# Altium project LimeSDR-Mini_2v4.PrjPcb (part 1 of 2)
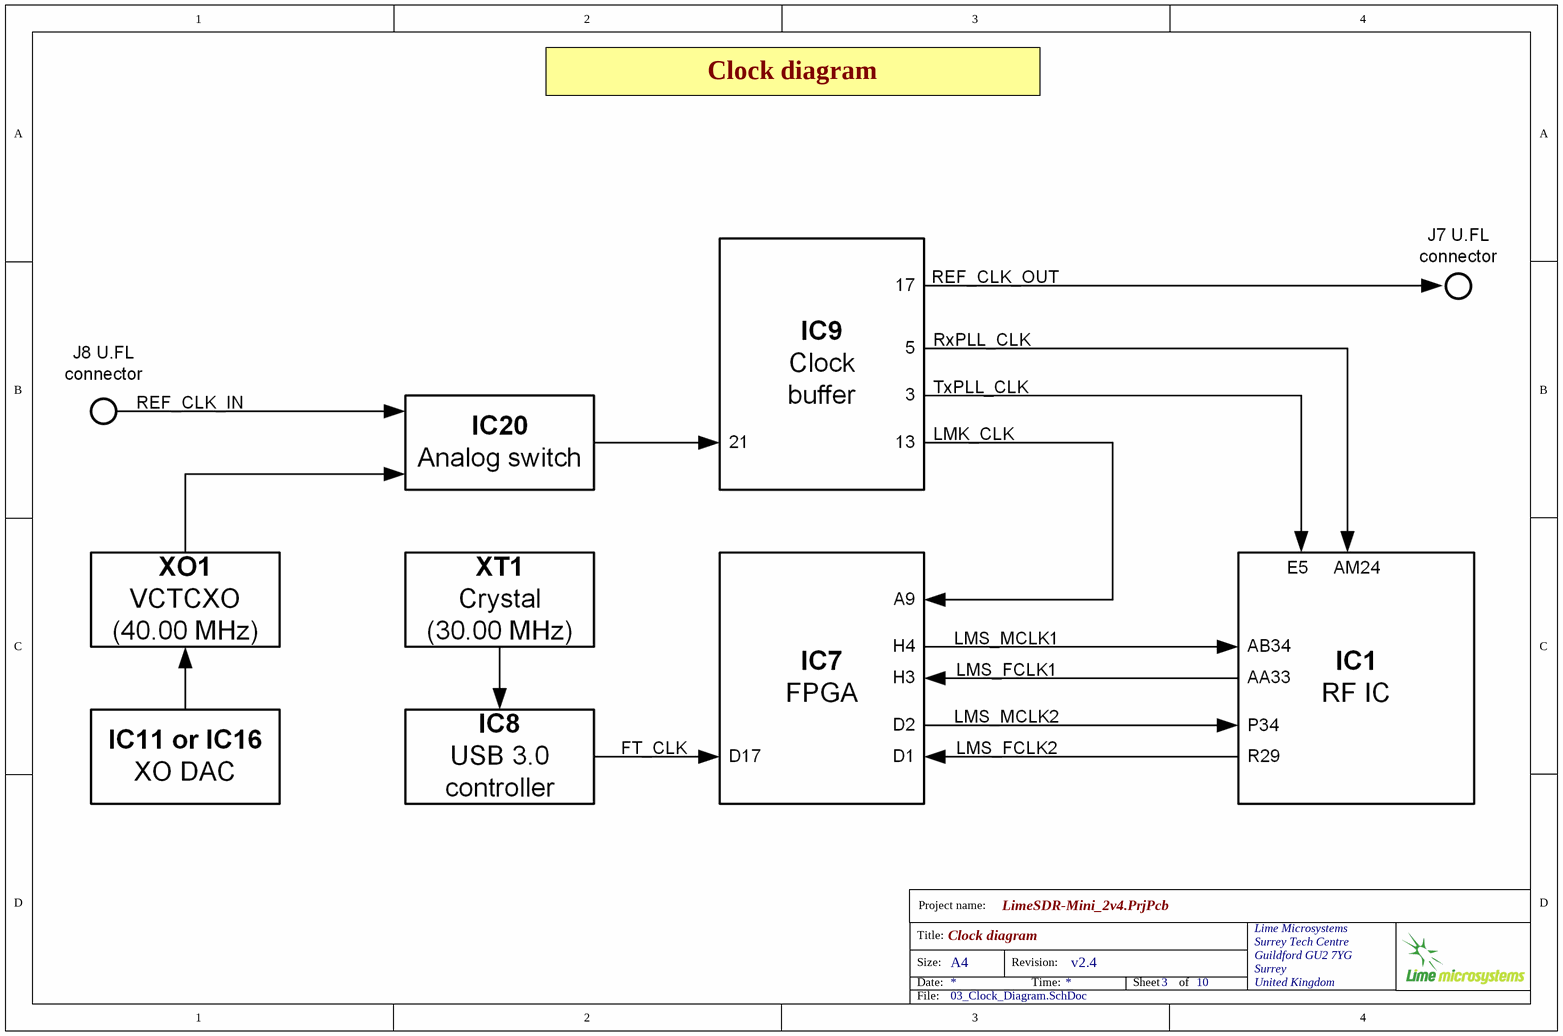
[diagram p0: 03_Clock_Diagram.SchDoc]
5 sheets, 279 parts. Net scope: global (net labels, ports and power ports of the same name join across sheets).
Board files: LimeSDR-Mini_2v4_Rounded.PcbDoc, LimeSDR-Mini_2v4_Rounded_panel.PcbDoc
Sheets:
  03_Clock_Diagram.SchDoc
  04_RF_Diagram.SchDoc
  07_LMS7002M_Power.SchDoc
  09_USB3_0_FIFO.SchDoc
  10_Misc.SchDoc

## Sheet 03_Clock_Diagram.SchDoc: Clock diagram
size A4; Organization: Lime Microsystems; Address1: Surrey Tech Centre; Address2: Guildford GU2 7YG; Address3: Surrey; Address4: United Kingdom; Revision: v2.4; SheetNumber: 3; SheetTotal: 10

### Notes on the sheet
- Clock diagram
- Project name:
- Title:
- Size:
- Date:
- A4
- Revision:
- Time:
- Sheet
- of
- File:

## Sheet 04_RF_Diagram.SchDoc: RF diagram
size A4; Organization: Lime Microsystems; Address1: Surrey Tech Centre; Address2: Guildford GU2 7YG; Address3: Surrey; Address4: United Kingdom; Revision: v2.4; SheetNumber: 4; SheetTotal: 10
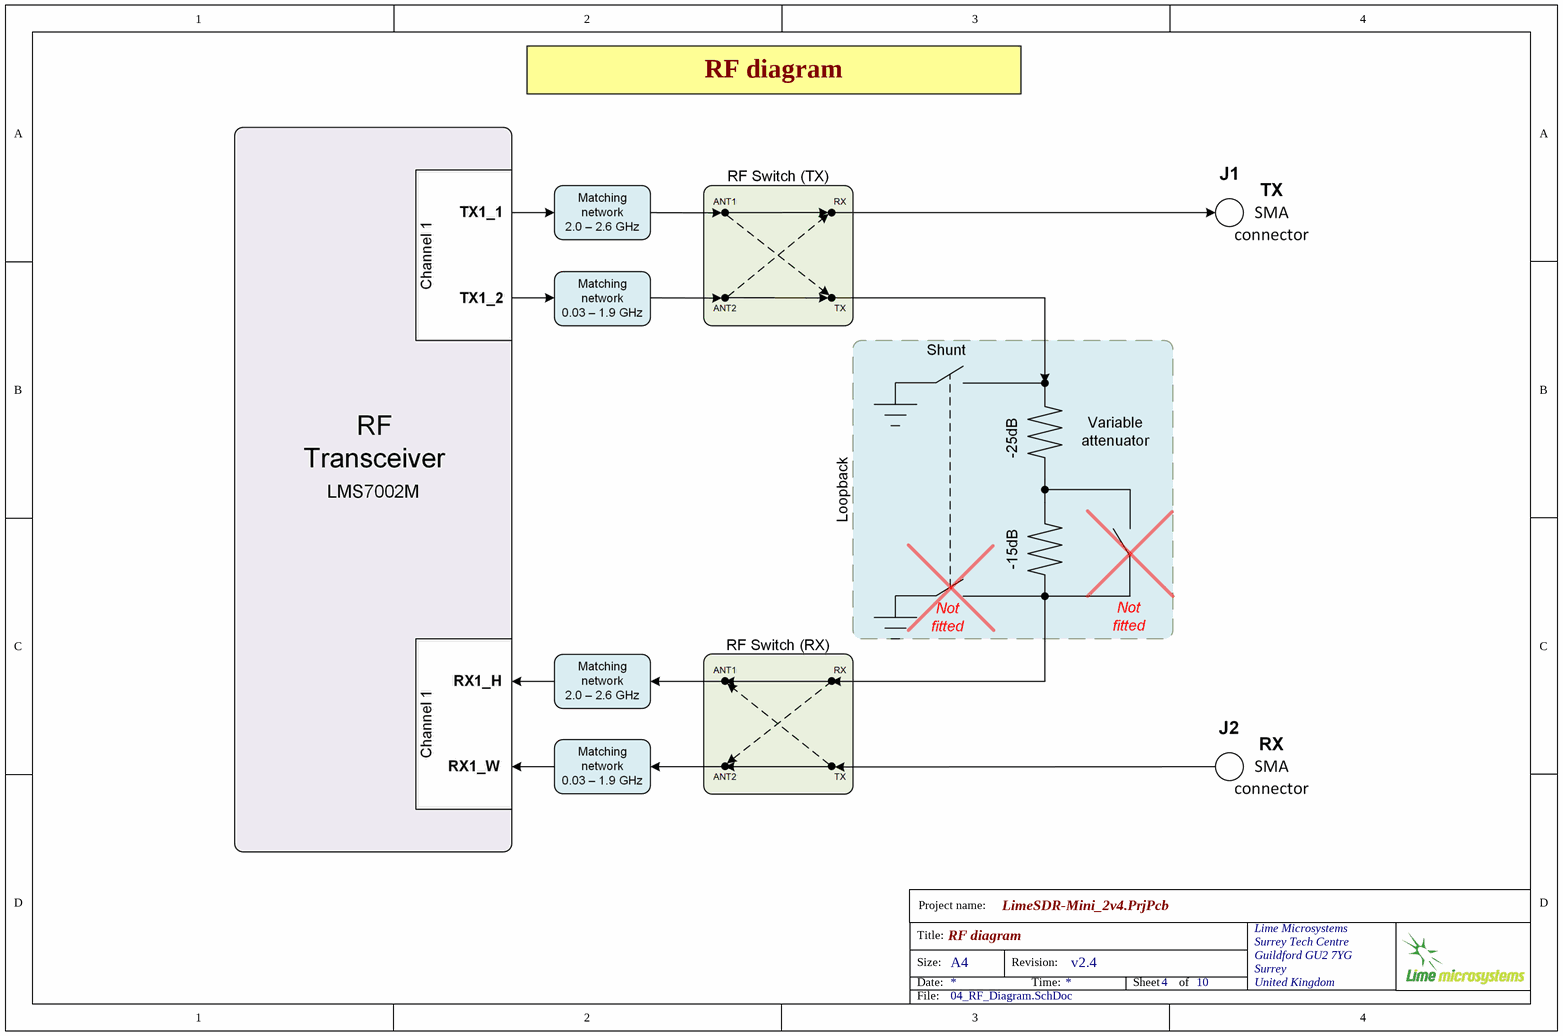
[diagram p1: 04_RF_Diagram.SchDoc]

### Notes on the sheet
- RF diagram
- Project name:
- Title:
- Size:
- Date:
- A4
- Revision:
- Time:
- Sheet
- of
- File:

## Sheet 07_LMS7002M_Power.SchDoc: LMS7002M power
size A3; Organization: Lime Microsystems; Address1: Surrey Tech Centre; Address2: Guildford GU2 7YG; Address3: Surrey; Address4: United Kingdom; Revision: v2.4; SheetNumber: 7; SheetTotal: 10
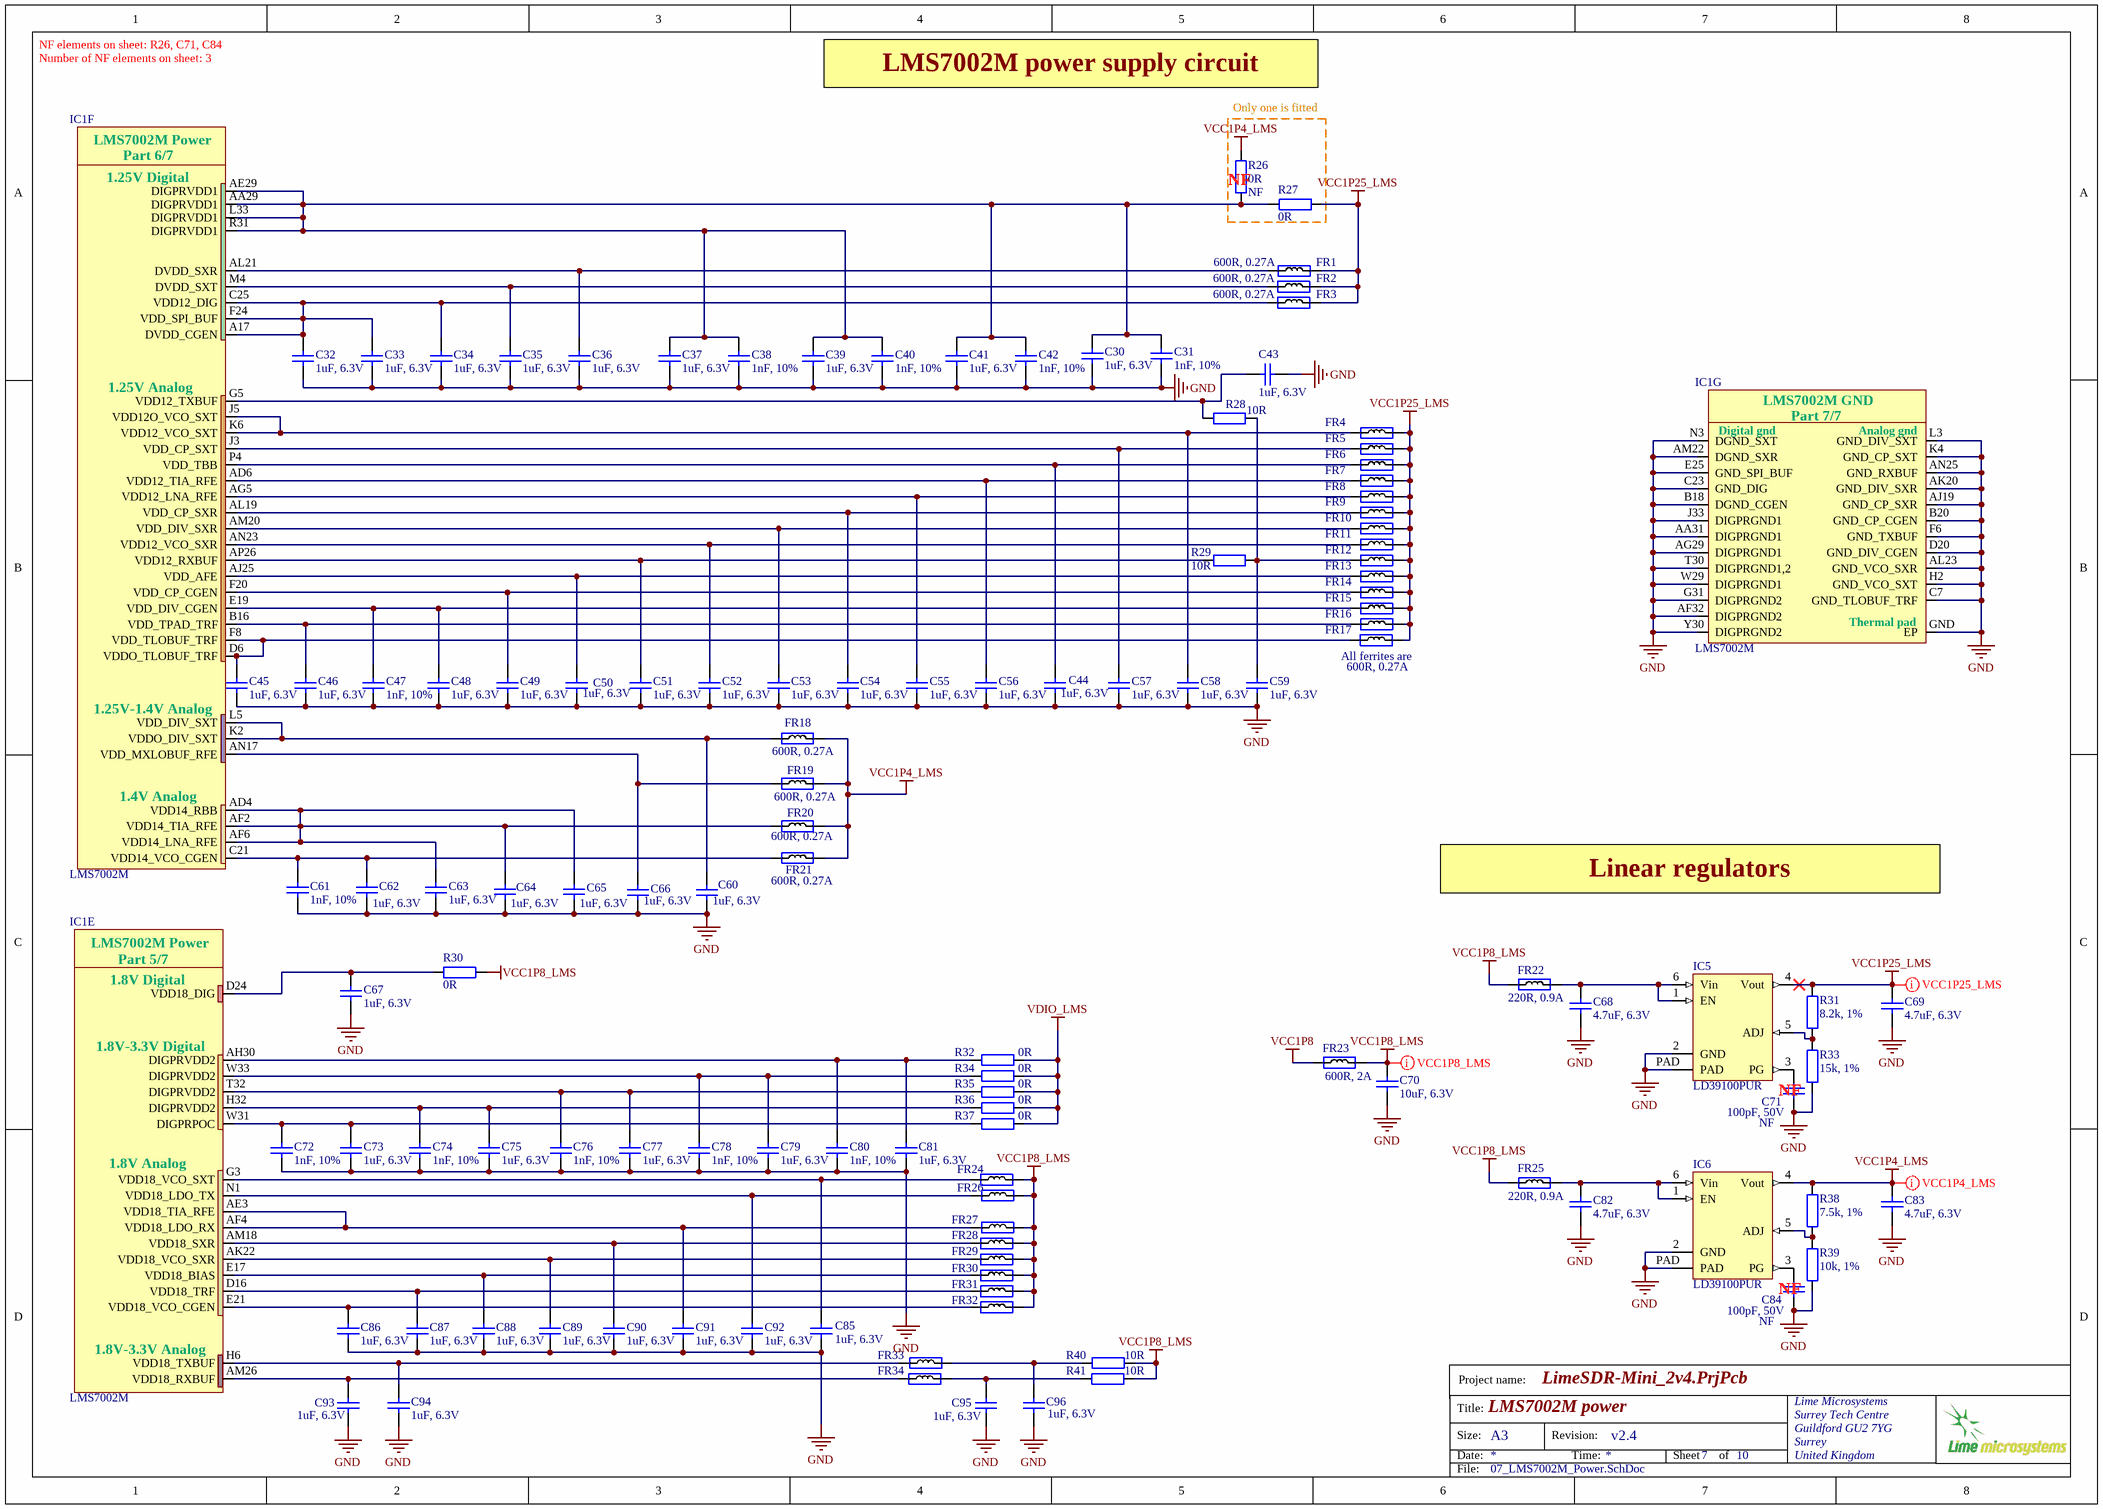
[diagram p2: 07_LMS7002M_Power.SchDoc]

### Parts
C30  1uF, 6.3V  [CAP0201]
C31  1nF, 10%  [CAP0201]
C32  1uF, 6.3V  [CAP0201]
C33  1uF, 6.3V  [CAP0201]
C34  1uF, 6.3V  [CAP0201]
C35  1uF, 6.3V  [CAP0201]
C36  1uF, 6.3V  [CAP0201]
C37  1uF, 6.3V  [CAP0201]
C38  1nF, 10%  [CAP0201]
C39  1uF, 6.3V  [CAP0201]
C40  1nF, 10%  [CAP0201]
C41  1uF, 6.3V  [CAP0201]
C42  1nF, 10%  [CAP0201]
C43  1uF, 6.3V  [CAP0201]
C44  1uF, 6.3V  [CAP0201]
C45  1uF, 6.3V  [CAP0201]
C46  1uF, 6.3V  [CAP0201]
C47  1nF, 10%  [CAP0201]
C48  1uF, 6.3V  [CAP0201]
C49  1uF, 6.3V  [CAP0201]
C50  1uF, 6.3V  [CAP0201]
C51  1uF, 6.3V  [CAP0201]
C52  1uF, 6.3V  [CAP0201]
C53  1uF, 6.3V  [CAP0201]
C54  1uF, 6.3V  [CAP0201]
C55  1uF, 6.3V  [CAP0201]
C56  1uF, 6.3V  [CAP0201]
C57  1uF, 6.3V  [CAP0201]
C58  1uF, 6.3V  [CAP0201]
C59  1uF, 6.3V  [CAP0201]
C60  1uF, 6.3V  [CAP0201]
C61  1nF, 10%  [CAP0201]
C62  1uF, 6.3V  [CAP0201]
C63  1uF, 6.3V  [CAP0201]
C64  1uF, 6.3V  [CAP0201]
C65  1uF, 6.3V  [CAP0201]
C66  1uF, 6.3V  [CAP0201]
C67  1uF, 6.3V  [CAP0201]
C68  4.7uF, 6.3V  [CAP0402]
C69  4.7uF, 6.3V  [CAP0402]
C70  10uF, 6.3V  [CAP0603]
C71  100pF, 50V  Assembly Info: NF  [CAP0402]
C72  1nF, 10%  [CAP0201]
C73  1uF, 6.3V  [CAP0201]
C74  1nF, 10%  [CAP0201]
C75  1uF, 6.3V  [CAP0201]
C76  1nF, 10%  [CAP0201]
C77  1uF, 6.3V  [CAP0201]
C78  1nF, 10%  [CAP0201]
C79  1uF, 6.3V  [CAP0201]
C80  1nF, 10%  [CAP0201]
C81  1uF, 6.3V  [CAP0201]
C82  4.7uF, 6.3V  [CAP0402]
C83  4.7uF, 6.3V  [CAP0402]
C84  100pF, 50V  Assembly Info: NF  [CAP0402]
C85  1uF, 6.3V  [CAP0201]
C86  1uF, 6.3V  [CAP0201]
C87  1uF, 6.3V  [CAP0201]
C88  1uF, 6.3V  [CAP0201]
C89  1uF, 6.3V  [CAP0201]
C90  1uF, 6.3V  [CAP0201]
C91  1uF, 6.3V  [CAP0201]
C92  1uF, 6.3V  [CAP0201]
C93  1uF, 6.3V  [CAP0201]
C94  1uF, 6.3V  [CAP0201]
C95  1uF, 6.3V  [CAP0201]
C96  1uF, 6.3V  [CAP0201]
FR1  600R, 0.27A  [RES0201]
FR2  600R, 0.27A  [RES0201]
FR3  600R, 0.27A  [RES0201]
FR4  600R, 0.27A  [RES0201]
FR5  600R, 0.27A  [RES0201]  (value not drawn)
FR6  600R, 0.27A  [RES0201]  (value not drawn)
FR7  600R, 0.27A  [RES0201]  (value not drawn)
FR8  600R, 0.27A  [RES0201]  (value not drawn)
FR9  600R, 0.27A  [RES0201]  (value not drawn)
FR10  600R, 0.27A  [RES0201]  (value not drawn)
FR11  600R, 0.27A  [RES0201]  (value not drawn)
FR12  600R, 0.27A  [RES0201]  (value not drawn)
FR13  600R, 0.27A  [RES0201]  (value not drawn)
FR14  600R, 0.27A  [RES0201]  (value not drawn)
FR15  600R, 0.27A  [RES0201]  (value not drawn)
FR16  600R, 0.27A  [RES0201]  (value not drawn)
FR17  600R, 0.27A  [RES0201]  (value not drawn)
FR18  600R, 0.27A  [RES0201]
FR19  600R, 0.27A  [RES0201]
FR20  600R, 0.27A  [RES0201]
FR21  600R, 0.27A  [RES0201]
FR22  220R, 0.9A  [RES0402]
FR23  600R, 2A  [RES0805]
FR24  600R, 0.27A  [RES0201]  (value not drawn)
FR25  220R, 0.9A  [RES0402]
FR26  600R, 0.27A  [RES0201]  (value not drawn)
FR27  600R, 0.27A  [RES0201]  (value not drawn)
FR28  600R, 0.27A  [RES0201]  (value not drawn)
FR29  600R, 0.27A  [RES0201]  (value not drawn)
FR30  600R, 0.27A  [RES0201]  (value not drawn)
FR31  600R, 0.27A  [RES0201]  (value not drawn)
FR32  600R, 0.27A  [RES0201]  (value not drawn)
FR33  600R, 0.27A  [RES0201]  (value not drawn)
FR34  600R, 0.27A  [RES0201]  (value not drawn)
IC1  LMS7002M  [LMS7002M_v5]  (parts E,F,G of 7)
IC5  LD39100PUR  [LD39100PUR]
IC6  LD39100PUR  [LD39100PUR]
R26  0R  Assembly Info: NF  [RES0402]
R27  0R  [RES0402]
R28  10R  [RES0201]
R29  10R  [RES0201]
R30  0R  [RES0201]
R31  8.2k, 1%  [RES0402]
R32  0R  [RES0402]
R33  15k, 1%  [RES0402]
R34  0R  [RES0402]
R35  0R  [RES0402]
R36  0R  [RES0402]
R37  0R  [RES0402]
R38  7.5k, 1%  [RES0402]
R39  10k, 1%  [RES0402]
R40  10R  [RES0201]
R41  10R  [RES0201]

### Blocks framed on the sheet
Only one is fitted: R26 R27

### Nets
GND: C30.2 C31.2 C32.2 C33.2 C34.2 C35.1 C36.2 C37.2 C38.2 C39.2 C40.2 C41.2 C42.2 C43.2 C44.2 C45.2 C46.2 C47.2 C48.2 C49.1 C50.2 C51.2 C52.2 C53.2 C54.2 C55.2 C56.1 C57.2 C58.1 C59.1 C60.2 C61.2 C62.2 C63.2 C64.2 C65.2 C66.2 C67.2 C68.1 C69.1 C70.1 C71.1 C72.2 C73.2 C74.2 C75.2 C76.2 C77.2 C78.2 C79.2 C80.2 C81.2 C82.1 C83.1 C84.1 C85.2 C86.2 C87.2 C88.2 C89.2 C90.2 C91.2 C92.2 C93.2 C94.2 C95.2 C96.2 IC1.AA31(DIGPRGND1) IC1.AF32(DIGPRGND2) IC1.AG29(DIGPRGND1) IC1.AJ19(GND_CP_SXR) IC1.AK20(GND_DIV_SXR) IC1.AL23(GND_VCO_SXR) IC1.AM22(DGND_SXR) IC1.AN25(GND_RXBUF) IC1.B18(DGND_CGEN) IC1.B20(GND_CP_CGEN) IC1.C7(GND_TLOBUF_TRF) IC1.C23(GND_DIG) IC1.D20(GND_DIV_CGEN) IC1.E25(GND_SPI_BUF) IC1.F6(GND_TXBUF) IC1.G31(DIGPRGND2) IC1.GND(EP) IC1.H2(GND_VCO_SXT) IC1.J33(DIGPRGND1) IC1.K4(GND_CP_SXT) IC1.L3(GND_DIV_SXT) IC1.N3(DGND_SXT) IC1.T30(DIGPRGND1,2) IC1.W29(DIGPRGND1) IC1.Y30(DIGPRGND2) IC5.2(GND) IC5.PAD IC6.2(GND) IC6.PAD R33.1 R39.1
VCC1P4_LMS: C83.2 FR18.2 FR19.2 FR20.2 FR21.2 IC6.4(Vout) R26.1 R38.2
VCC1P8: FR23.1
VCC1P8_LMS: C70.2 FR22.1 FR23.2 FR24.2 FR25.1 FR26.1 FR27.1 FR28.2 FR29.2 FR30.2 FR31.2 FR32.2 R30.2 R40.2 R41.1
VCC1P25_LMS: C69.2 FR1.2 FR2.2 FR3.2 FR4.2 FR5.2 FR6.2 FR7.2 FR8.2 FR9.2 FR10.2 FR11.2 FR12.2 FR13.2 FR14.2 FR15.2 FR16.2 FR17.2 IC5.4(Vout) R27.1 R31.2
VDIO_LMS: R32.1 R34.1 R35.1 R36.1 R37.1
NetC30_1: C30.1 C31.1 C37.1 C38.1 C39.1 C40.1 C41.1 C42.1 IC1.AA29(DIGPRVDD1) IC1.AE29(DIGPRVDD1) IC1.L33(DIGPRVDD1) IC1.R31(DIGPRVDD1) R26.2 R27.2
NetC32_1: C32.1 C33.1 C34.1 FR3.1 IC1.A17(DVDD_CGEN) IC1.C25(VDD12_DIG) IC1.F24(VDD_SPI_BUF)
NetC35_2: C35.2 FR2.1 IC1.M4(DVDD_SXT)
NetC36_1: C36.1 FR1.1 IC1.AL21(DVDD_SXR)
NetC43_1: C43.1 IC1.G5(VDD12_TXBUF) R28.1
NetC44_1: C44.1 FR6.1 IC1.P4(VDD_TBB)
NetC45_1: C45.1 FR17.1 IC1.D6(VDDO_TLOBUF_TRF) IC1.F8(VDD_TLOBUF_TRF)
NetC46_1: C46.1 FR16.1 IC1.B16(VDD_TPAD_TRF)
NetC47_1: C47.1 C48.1 FR15.1 IC1.E19(VDD_DIV_CGEN)
NetC49_2: C49.2 FR14.1 IC1.F20(VDD_CP_CGEN)
NetC50_1: C50.1 FR13.1 IC1.AJ25(VDD_AFE)
NetC51_1: C51.1 IC1.AP26(VDD12_RXBUF) R29.1
NetC52_1: C52.1 FR11.1 IC1.AN23(VDD12_VCO_SXR)
NetC53_1: C53.1 FR10.1 IC1.AM20(VDD_DIV_SXR)
NetC54_1: C54.1 FR9.1 IC1.AL19(VDD_CP_SXR)
NetC55_1: C55.1 FR8.1 IC1.AG5(VDD12_LNA_RFE)
NetC56_2: C56.2 FR7.1 IC1.AD6(VDD12_TIA_RFE)
NetC57_1: C57.1 FR5.1 IC1.J3(VDD_CP_SXT)
NetC58_2: C58.2 FR4.1 IC1.J5(VDD12O_VCO_SXT) IC1.K6(VDD12_VCO_SXT)
NetC59_2: C59.2 FR12.1 R28.2 R29.2
NetC60_1: C60.1 FR18.1 IC1.K2(VDDO_DIV_SXT) IC1.L5(VDD_DIV_SXT)
NetC61_1: C61.1 C62.1 FR21.1 IC1.C21(VDD14_VCO_CGEN)
NetC63_1: C63.1 C64.1 C65.1 FR20.1 IC1.AD4(VDD14_RBB) IC1.AF2(VDD14_TIA_RFE) IC1.AF6(VDD14_LNA_RFE)
NetC66_1: C66.1 FR19.1 IC1.AN17(VDD_MXLOBUF_RFE)
NetC67_1: C67.1 IC1.D24(VDD18_DIG) R30.1
NetC68_2: C68.2 FR22.2 IC5.1(EN) IC5.6(Vin)
NetC71_2: C71.2 IC5.3(PG)
NetC72_1: C72.1 C73.1 IC1.W31(DIGPRPOC) R37.2
NetC74_1: C74.1 C75.1 IC1.H32(DIGPRVDD2) R36.2
NetC76_1: C76.1 C77.1 IC1.T32(DIGPRVDD2) R35.2
NetC78_1: C78.1 C79.1 IC1.W33(DIGPRVDD2) R34.2
NetC80_1: C80.1 C81.1 IC1.AH30(DIGPRVDD2) R32.2
NetC82_2: C82.2 FR25.2 IC6.1(EN) IC6.6(Vin)
NetC84_2: C84.2 IC6.3(PG)
NetC85_1: C85.1 FR24.1 IC1.G3(VDD18_VCO_SXT)
NetC86_1: C86.1 FR32.1 IC1.E21(VDD18_VCO_CGEN)
NetC87_1: C87.1 FR31.1 IC1.D16(VDD18_TRF)
NetC88_1: C88.1 FR30.1 IC1.E17(VDD18_BIAS)
NetC89_1: C89.1 FR29.1 IC1.AK22(VDD18_VCO_SXR)
NetC90_1: C90.1 FR28.1 IC1.AM18(VDD18_SXR)
NetC91_1: C91.1 FR27.2 IC1.AE3(VDD18_TIA_RFE) IC1.AF4(VDD18_LDO_RX)
NetC92_1: C92.1 FR26.2 IC1.N1(VDD18_LDO_TX)
NetC93_1: C93.1 FR34.1 IC1.AM26(VDD18_RXBUF)
NetC94_1: C94.1 FR33.2 IC1.H6(VDD18_TXBUF)
NetC95_1: C95.1 FR34.2 R41.2
NetC96_1: C96.1 FR33.1 R40.1
NetIC5_5: IC5.5(ADJ) R31.1 R33.2
NetIC6_5: IC6.5(ADJ) R38.1 R39.2

### Layout directives
net class VCC1P25_LMS: VCC1P25_LMS
net class VCC1P4_LMS: VCC1P4_LMS
net class VCC1P8_LMS: VCC1P8_LMS

### Notes on the sheet
- NF elements on sheet: R26, C71, C84
- Number of NF elements on sheet: 3
- LMS7002M power supply circuit
- (near R26) NF
- (near FR17) All ferrites are
- Linear regulators
- NF
- Project name:
- Title:
- Size:
- Date:
- A3
- Revision:
- Time:
- Sheet
- of
- File:
- (in symbol LMS7002Mr4, part E) LMS7002M Power; Part 5/7; 1.8V Digital; 1.8V-3.3V Digital; 1.8V Analog; 1.8V-3.3V Analog
- (in symbol LMS7002Mr4, part F) LMS7002M Power; Part 6/7; 1.25V Digital; 1.25V Analog; 1.25V-1.4V Analog; 1.4V Analog
- (in symbol LMS7002Mr4, part G) LMS7002M GND; Part 7/7; Digital gnd; Analog gnd; Thermal pad

### Library data of the parts
C30 C32-C37 C39 C41 C43-C46 C48-C60 C62-C67 C73 C75 C77 C79 C81 C85-C96 = Cap_0402: Manufacturer: TDK Corporation; Manufacturer Part Number 1: JMK063ABJ105MP-F; Part Description: 1µF ±20% 6.3V X5R Ceramic Capacitor -55°C ~ 85°C Surface Mount, MLCC 0201 (0603 Metric) 0.024" L x 0.012" W (0.60mm x 0.30mm); Value: 1uF, 20%; Tolerance: ±20%; Capacitance: 1.0µF; Temperature Coefficient: X5R; Supplier 1: Digi-Key; Supplier Part Number 1: 587-5864-2-ND; Applications: General Purpose; Features: -; Lead Style: -; Ratings: -; Thickness (Max): -; Lead Spacing: -; Height - Seated (Max): -; Size / Dimension: 0.024" L x 0.012" W (0.60mm x 0.30mm); Mounting Type: Surface Mount, MLCC; Operating Temperature: -55°C ~ 85°C; Package / Case: 0201 (0603 Metric); Packaging: Cut Tape (CT); Voltage - Rated: 6.3V; Category: Capacitors; RoHS: RoHS Compliant
C31 C38 C40 C42 C47 C61 C72 C74 C76 C78 C80 = Cap_0402: Manufacturer Part Number 1: C0603X7R1E102K030BA; Manufacturer: TDK Corporation; Part Description: 1000pF ±10% 25V X7R Ceramic Capacitor -55°C ~ 125°C Surface Mount, MLCC 0201 (0603 Metric) 0.024" L x 0.012" W (0.60mm x 0.30mm); Voltage - Rated: 25V; Temperature Coefficient: X7R; Capacitance: 1000pF; Value: 1nF, 10%; Supplier 1: Digi-Key; Supplier Part Number 1: 445-7275-1-ND; Features: -; Package / Case: 0201 (0603 Metric); Lead Spacing: -; Mounting Type: Surface Mount, MLCC; Lead Style: -; Height - Seated (Max): -; Operating Temperature: -55°C ~ 125°C; Tolerance: ±10%; Size / Dimension: 0.024" L x 0.012" W (0.60mm x 0.30mm); Applications: General Purpose; Ratings: -; Thickness (Max): 0.013" (0.33mm); RoHS: RoHS Compliant; Packaging: Cut Tape (CT); Category: Capacitors
C68 C69 C82 C83 = Cap_0402: Manufacturer: Murata Electronics North America; Manufacturer Part Number 1: GRM155R60J475ME87D; Part Description: 4.7µF ±20% 6.3V X5R Ceramic Capacitor -55°C ~ 85°C Surface Mount, MLCC 0402 (1005 Metric) 0.039" L x 0.020" W (1.00mm x 0.50mm); Tolerance: ±20%; Capacitance: 4.7µF; Temperature Coefficient: X5R; Lead Style: -; Ratings: -; Height - Seated (Max): -; Thickness (Max): 0.022" (0.55mm); Voltage - Rated: 6.3V; Packaging: Cut Tape (CT); Lead Spacing: -; Category: Capacitors; Supplier Part Number 1: 490-5408-1-ND; Applications: General Purpose; Operating Temperature: -55°C ~ 85°C; Mounting Type: Surface Mount, MLCC; Features: Derating Recommended; RoHS: RoHS Compliant; Supplier 1: Digi-Key; Package / Case: 0402 (1005 Metric); Size / Dimension: 0.039" L x 0.020" W (1.00mm x 0.50mm); Value: 4.7uF, 6.3V
C70 = Cap_0603: Manufacturer Part Number 1: CC0603MRX5R5BB106; Manufacturer: Yageo; Part Description: 10µF ±20% 6.3V X5R Ceramic Capacitor -55°C ~ 85°C Surface Mount, MLCC 0603 (1608 Metric) 0.063" L x 0.031" W (1.60mm x 0.80mm); Capacitance: 10µF; Tolerance: ±20%; Supplier 1: Digi-Key; Supplier Part Number 1: 311-1448-2-ND; Package / Case: 0603 (1608 Metric); Category: Capacitors; Voltage - Rated: 6.3V; Value: 10uF, 6.3V
C71 C84 = Cap_0402: Manufacturer Part Number 1: CC0402JRNPO9BN101; Manufacturer: Yageo; Part Description: 100pF ±5% 50V C0G, NP0 Ceramic Capacitor -55°C ~ 125°C Surface Mount, MLCC 0402 (1005 Metric) 0.039" L x 0.020" W (1.00mm x 0.50mm); Temperature Coefficient: C0G, NP0; Tolerance: ±5%; Value: 100pF, 50V; Supplier 1: Digi-Key; Supplier Part Number 1: 311-1024-1-ND; RoHS: RoHS Compliant; Category: Capacitors; Applications: General Purpose; Mounting Type: Surface Mount, MLCC; Capacitance: 100pF; Ratings: -; Packaging: Cut Tape (CT); Voltage - Rated: 50V; Size / Dimension: 0.039" L x 0.020" W (1.00mm x 0.50mm); Height - Seated (Max): -; Package / Case: 0402 (1005 Metric); Operating Temperature: -55°C ~ 125°C; Features: -; Lead Spacing: -; Lead Style: -; Thickness (Max): 0.022" (0.55mm)
FR1-FR21 FR24 FR26-FR34 = Ferrite: Manufacturer Part Number 1: BK0603TS601-T; Manufacturer: Taiyo Yuden; Part Description: FERRITE BEAD 600 OHM 0201 1LN; DC Resistance (DCR): 750 mOhm Max; Filter Type: Differential Mode - Single; Impedance @ Frequency: 600 Ohm @ 100MHz; Current Rating: 270mA; Value: 600R@100MHz; Supplier 1: Digi-Key; Supplier Part Number 1: 587-3277-1-ND; Size / Dimension: 0.024" L x 0.012" W (0.60mm x 0.30mm); Package / Case: 0201 (0603 Metric); Height (Max): 0.013" (0.33mm); Mounting Type: Surface Mount; Packaging: Cut Tape (CT); RoHS: RoHS Compliant; Category: Filters
FR22 FR25 = Ferrite: Manufacturer: TDK Corporation; Manufacturer Part Number 1: MPZ1005S221ET000; Part Description: FERRITE BEAD 220 OHM 0402 1LN; Impedance @ Frequency: 220 Ohm @ 100MHz; Current Rating: 900mA; DC Resistance (DCR): 220 mOhm Max; Supplier 1: Digi-Key; Package / Case: 0402 (1005 Metric); Category: Filters; Supplier Part Number 1: 445-9329-2-ND; Value: 220R, 0.9A
FR23 = Ferrite: Manufacturer Part Number 1: MPZ2012S601AT000; Manufacturer: TDK Corporation; Part Description: FERRITE BEAD 600 OHM 0805 1LN; Filter Type: Differential Mode - Single; Impedance @ Frequency: 600 Ohm @ 100MHz; DC Resistance (DCR): 100 mOhm Max; Supplier 1: Digi-Key; Supplier Part Number 1: 445-2206-2-ND; Mounting Type: Surface Mount; RoHS: RoHS Compliant; Height (Max): 0.041" (1.05mm); Packaging: Tape & Reel (TR); Category: Filters; Current Rating: 2A; Package / Case: 0805 (2012 Metric); Size / Dimension: 0.079" L x 0.049" W (2.00mm x 1.25mm)
IC1 = LMS7002Mr4: Schematic symbol revision 4. Default footprint - 0.31mm pad; Manufacturer: Lime Microsystems; Part Description: IC FPRF Transceiver LMS7002M; 261 pin aQFN; Supplier 1: Lime Microsystems; Supplier Part Number 1: LMS7002M; Manufacturer Part Number 1: LMS7002M
IC5 IC6 = LD39100PUR: Manufacturer: STMicroelectronics; Part Description: Linear Voltage Regulator IC Positive Adjustable Output 0.8 V ~ 4.5 V 1A 6-DFN (3x3); Output Configuration: Positive; Output Type: Adjustable; Voltage - Input (Max): 5.5V; Voltage - Output (Min/Fixed): 0.8V; Voltage - Output (Max): 4.6V; Voltage Dropout (Max): 0.4V @ 1A; Current - Output: 1A; Current - Supply: 50µA ~ 300µA; PSRR: 70dB ~ 65dB (1kHz ~ 10kHz); Control Features: Enable, Power Good; Protection Features: Over Current, Over Temperature, Short Circuit; Supplier 1: Digi-Key; Manufacturer Part Number 1: LD39100PUR; RoHS: RoHS Compliant; Category: Integrated Circuits (ICs); Stock 1: 27970; Pricing 1: 1=0.85, 10=0.76, 100=0.5923, 500=0.48926, 1000=0.38625 (USD); Packaging: Cut Tape (CT); Part Status: Active; Operating Temperature: -40°C ~ 125°C; Mounting Type: Surface Mount; Package / Case: 6-VDFN Exposed Pad; Supplier Device Package: 6-DFN (3x3); ComponentLink1URL: http://www.st.com/content/ccc/resource/technical/document/datasheet/72/02/e5/ee/df/36/40/5e/CD00233788.pdf/files/CD00233788.pdf/jcr:content/translations/en.CD00233788.pdf; ComponentLink1Description: http://www.st.com/content/ccc/resource/technical/document/datasheet/72/02/e5/ee/df/36/40/5e/CD00233788.pdf/files/CD00233788.pdf/jcr:content/translations/en.CD00233788.pdf; Supplier Part Number 1: 497-11013-1-ND
R26 R27 R32 R34-R37 = Res_0402: Manufacturer Part Number 1: RC0402JR-070RL; Manufacturer: Yageo; Part Description: RES SMD 0.0OHM JUMPER 1/16W 0402; Resistance (Ohms): 0.0; Tolerance: Jumper; Power (Watts): 0.063W, 1/16W; Value: 0R; Supplier 1: Digi-Key; Supplier Part Number 1: 311-0.0JRTR-ND; Category: Resistors; Temperature Coefficient: -; Features: Moisture Resistant; Supplier Device Package: 0402; Height: 0.016" (0.40mm); Package / Case: 0402 (1005 Metric); Operating Temperature: -55°C ~ 155°C; Size / Dimension: 0.039" L x 0.020" W (1.00mm x 0.50mm); Composition: Thick Film; Packaging: Tape & Reel (TR); Number of Terminations: 2; RoHS: RoHS Compliant
R28 R29 R40 R41 = Res_0402: Manufacturer: Panasonic Electronic Components; Part Description: RES SMD 10 OHM 1% 1/20W 0201; Manufacturer Part Number 1: ERJ-1GEF10R0C; Power (Watts): 0.05W, 1/20W; Resistance (Ohms): 10; Tolerance: ±1%; Temperature Coefficient: ±200ppm/°C; Value: 10R; Supplier 1: Digi-Key; Supplier Part Number 1: P10.0ABCT-ND; Package / Case: 0201 (0603 Metric); Height: 0.010" (0.26mm); Supplier Device Package: 0201; Packaging: Cut Tape (CT); Composition: Thick Film; Category: Resistors; Number of Terminations: 2; Size / Dimension: 0.024" L x 0.012" W (0.60mm x 0.30mm); Operating Temperature: -55°C ~ 125°C; Features: -; RoHS: RoHS Compliant
R30 = Res_0402: Manufacturer Part Number 1: RC0201FR-070RL; Manufacturer: Rohm Semiconductor; Part Description: RES SMD 0.0OHM JUMPER 1/20W 0201; Resistance (Ohms): 0.0; Power (Watts): 0.063W, 1/16W; Tolerance: Jumper; Value: 0R; Supplier 1: Digi-Key; Supplier Part Number 1: 311-0.0MCT-ND; Number of Terminations: 2; Operating Temperature: -55°C ~ 155°C; Package / Case: 0201 (0603 Metric); Height: 0.016" (0.40mm); Supplier Device Package: 0402; Size / Dimension: 0.039" L x 0.020" W (1.00mm x 0.50mm); Temperature Coefficient: -; Category: Resistors; Features: Moisture Resistant; RoHS: RoHS Compliant; Composition: Thick Film; Packaging: Tape & Reel (TR)
R31 = Res_0402: Manufacturer: Yageo; Part Description: RES SMD 8.2K OHM 1% 1/16W 0402; Manufacturer Part Number 1: RC0402FR-078K2L; Power (Watts): 0.063W, 1/16W; Temperature Coefficient: ±100ppm/°C; Value: 8.2k, 1%; Supplier 1: Digi-Key; Supplier Device Package: 0402; Package / Case: 0402 (1005 Metric); Height: 0.016" (0.40mm); Supplier Part Number 1: 311-8.20KLRCT-ND; Number of Terminations: 2; Operating Temperature: -55°C ~ 155°C; Resistance (Ohms): 8.2k; Size / Dimension: 0.039" L x 0.020" W (1.00mm x 0.50mm); Composition: Thick Film; Category: Resistors; Tolerance: ±1%; Features: Moisture Resistant; RoHS: RoHS Compliant; Packaging: Cut Tape (CT)
R33 = Res_0402: Manufacturer: Yageo; Manufacturer Part Number 1: RC0402FR-0715KL; Part Description: RES SMD 15K OHM 1% 1/16W 0402; Temperature Coefficient: ±100ppm/°C; Power (Watts): 0.063W, 1/16W; Value: 15k, 1%; Category: Resistors; Number of Terminations: 2; RoHS: RoHS Compliant; Features: Moisture Resistant; Operating Temperature: -55°C ~ 155°C; Tolerance: ±1%; Composition: Thick Film; Resistance (Ohms): 15k; Failure Rate: -; Height - Seated (Max): 0.016" (0.40mm); Packaging: Cut Tape (CT); Supplier Device Package: 0402; Size / Dimension: 0.039" L x 0.020" W (1.00mm x 0.50mm); Package / Case: 0402 (1005 Metric); Part Status: Active; Supplier 1: Digi-Key; Supplier Part Number 1: 311-15.0KLRCT-ND
R38 = Res_0402: Manufacturer: Yageo; Manufacturer Part Number 1: RC0402FR-077K5L; Part Description: ±1% 0.063W, 1/16W Chip Resistor 0402 (1005 Metric) Automotive AEC-Q200, Moisture Resistant Thick Film; Power (Watts): 0.063W, 1/16W; Temperature Coefficient: ±100ppm/°C; Value: 7.5k, 1%; Operating Temperature: -55°C ~ 155°C; Height - Seated (Max): 0.016" (0.40mm); Supplier 1: Digi-Key; Composition: Thick Film; Packaging: Cut Tape (CT); Tolerance: ±1%; Category: Resistors; Part Status: Active; Failure Rate: -; Supplier Device Package: 0402; Features: Moisture Resistant; Supplier Part Number 1: YAG3512CT-ND; RoHS: RoHS Compliant; Package / Case: 0402 (1005 Metric); Size / Dimension: 0.039" L x 0.020" W (1.00mm x 0.50mm)
R39 = Res_0402: Manufacturer: Yageo; Manufacturer Part Number 1: RC0402FR-0710KL; Part Description: RES SMD 10K OHM 1% 1/16W 0402; Temperature Coefficient: ±100ppm/°C; Power (Watts): 0.063W, 1/16W; Value: 10k, 1%; Supplier 1: Digi-Key; Supplier Part Number 1: 311-10.0KLRTR-ND; Resistance (Ohms): 10k; Packaging: Tape & Reel (TR); RoHS: RoHS Compliant; Package / Case: 0402 (1005 Metric); Tolerance: ±1%; Operating Temperature: -55°C ~ 155°C; Size / Dimension: 0.039" L x 0.020" W (1.00mm x 0.50mm); Number of Terminations: 2; Category: Resistors; Height: 0.016" (0.40mm); Supplier Device Package: 0402; Features: Moisture Resistant; Composition: Thick Film

## Sheet 09_USB3_0_FIFO.SchDoc: USB3.0 device
size A3; Organization: Lime Microsystems; Address1: Surrey Tech Centre; Address2: Guildford GU2 7YG; Address3: Surray; Address4: United Kingdom; Revision: v2.4; SheetNumber: 9; SheetTotal: 10
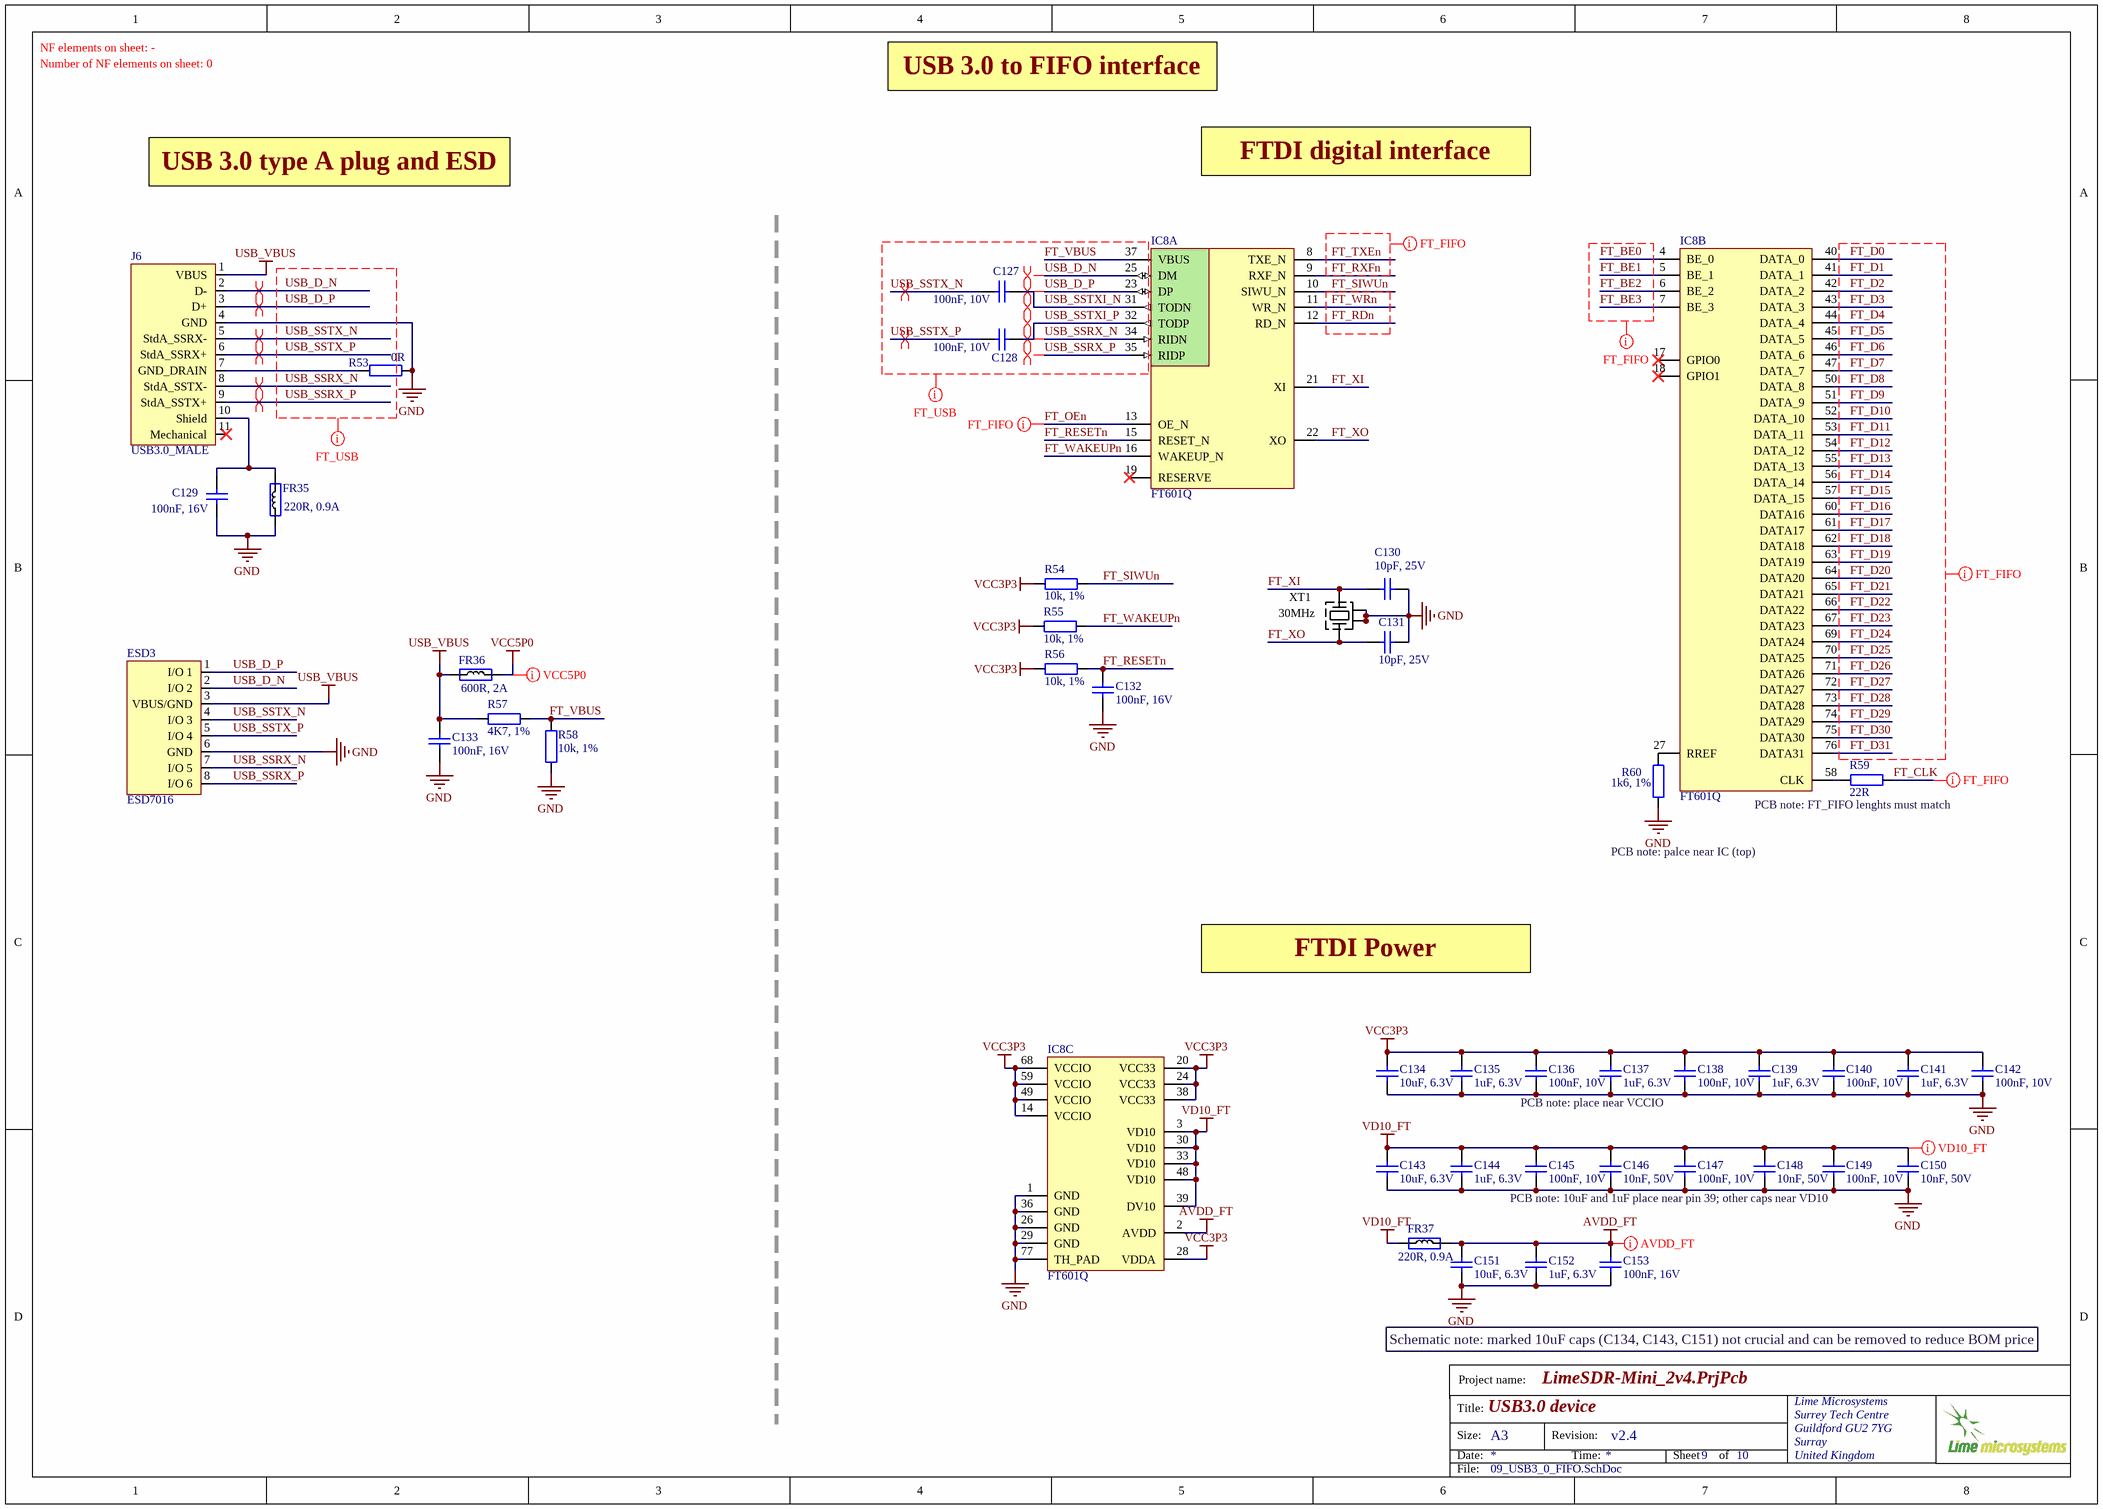
[diagram p3: 09_USB3_0_FIFO.SchDoc]

### Parts
C127  100nF, 10V  [CAP0201]
C128  100nF, 10V  [CAP0201]
C129  100nF, 16V  [CAP0402]
C130  10pF, 25V  [CAP0402]
C131  10pF, 25V  [CAP0402]
C132  100nF, 16V  [CAP0402]
C133  100nF, 16V  [CAP0402]
C134  10uF, 6.3V  [CAP0603]
C135  1uF, 6.3V  [CAP0201]
C136  100nF, 10V  [CAP0201]
C137  1uF, 6.3V  [CAP0201]
C138  100nF, 10V  [CAP0201]
C139  1uF, 6.3V  [CAP0201]
C140  100nF, 10V  [CAP0201]
C141  1uF, 6.3V  [CAP0201]
C142  100nF, 10V  [CAP0201]
C143  10uF, 6.3V  [CAP0603]
C144  1uF, 6.3V  [CAP0201]
C145  100nF, 10V  [CAP0201]
C146  10nF, 50V  [CAP0402]
C147  100nF, 10V  [CAP0201]
C148  10nF, 50V  [CAP0402]
C149  100nF, 10V  [CAP0201]
C150  10nF, 50V  [CAP0402]
C151  10uF, 6.3V  [CAP0603]
C152  1uF, 6.3V  [CAP0201]
C153  100nF, 16V  [CAP0402]
ESD3  ESD7016  [ESD7016]
FR35  220R, 0.9A  [RES0402]
FR36  600R, 2A  [RES0805]
FR37  220R, 0.9A  [RES0402]
IC8  FT601Q  [FT601Q]  (parts A,B,C of 3)
J6  USB3.0_MALE  [USB3A_SM]
R53  0R  [RES0402]
R54  10k, 1%  [RES0402]
R55  10k, 1%  [RES0402]
R56  10k, 1%  [RES0402]
R57  4K7, 1%  [RES0402]
R58  10k, 1%  [RES0402]
R59  22R  [RES0402]
R60  1k6, 1%  [RES0402]
XT1  30MHz  [CRYSTAL_4-LCC]

### Nets
AVDD_FT: C151.2 C152.2 C153.1 FR37.2 IC8.2(AVDD)
GND: C129.2 C130.2 C131.2 C132.2 C133.2 C134.1 C135.1 C136.2 C137.1 C138.2 C139.1 C140.2 C141.1 C142.2 C143.1 C144.1 C145.2 C146.2 C147.2 C148.2 C149.2 C150.2 C151.1 C152.1 C153.2 ESD3.6(GND) FR35.1 IC8.1(GND) IC8.26(GND) IC8.29(GND) IC8.36(GND) IC8.77(TH_PAD) J6.4(GND) R53.1 R58.1 R60.1 XT1.2(GND) XT1.4(GND)
USB_VBUS: C133.1 ESD3.3(VBUS/GND) FR36.1 J6.1(VBUS) R57.2
VCC3P3: C134.2 C135.2 C136.1 C137.2 C138.1 C139.2 C140.1 C141.2 C142.1 IC8.14(VCCIO) IC8.20(VCC33) IC8.24(VCC33) IC8.28(VDDA) IC8.38(VCC33) IC8.49(VCCIO) IC8.59(VCCIO) IC8.68(VCCIO) R54.2 R55.2 R56.2
VCC5P0: FR36.2
VD10_FT: C143.2 C144.2 C145.1 C146.1 C147.1 C148.1 C149.1 C150.1 FR37.1 IC8.3(VD10) IC8.30(VD10) IC8.33(VD10) IC8.39(DV10) IC8.48(VD10)
FT_BE0: IC8.4(BE_0)
FT_BE1: IC8.5(BE_1)
FT_BE2: IC8.6(BE_2)
FT_BE3: IC8.7(BE_3)
FT_CLK: R59.1
FT_D0: IC8.40(DATA_0)
FT_D1: IC8.41(DATA_1)
FT_D2: IC8.42(DATA_2)
FT_D3: IC8.43(DATA_3)
FT_D4: IC8.44(DATA_4)
FT_D5: IC8.45(DATA_5)
FT_D6: IC8.46(DATA_6)
FT_D7: IC8.47(DATA_7)
FT_D8: IC8.50(DATA_8)
FT_D9: IC8.51(DATA_9)
FT_D10: IC8.52(DATA_10)
FT_D11: IC8.53(DATA_11)
FT_D12: IC8.54(DATA_12)
FT_D13: IC8.55(DATA_13)
FT_D14: IC8.56(DATA_14)
FT_D15: IC8.57(DATA_15)
FT_D16: IC8.60(DATA16)
FT_D17: IC8.61(DATA17)
FT_D18: IC8.62(DATA18)
FT_D19: IC8.63(DATA19)
FT_D20: IC8.64(DATA20)
FT_D21: IC8.65(DATA21)
FT_D22: IC8.66(DATA22)
FT_D23: IC8.67(DATA23)
FT_D24: IC8.69(DATA24)
FT_D25: IC8.70(DATA25)
FT_D26: IC8.71(DATA26)
FT_D27: IC8.72(DATA27)
FT_D28: IC8.73(DATA28)
FT_D29: IC8.74(DATA29)
FT_D30: IC8.75(DATA30)
FT_D31: IC8.76(DATA31)
FT_OEn: IC8.13(OE_N)
FT_RDn: IC8.12(RD_N)
FT_RESETn: C132.1 IC8.15(RESET_N) R56.1
FT_RXFn: IC8.9(RXF_N)
FT_SIWUn: IC8.10(SIWU_N) R54.1
FT_TXEn: IC8.8(TXE_N)
FT_VBUS: IC8.37(VBUS) R57.1 R58.2
FT_WAKEUPn: IC8.16(WAKEUP_N) R55.1
FT_WRn: IC8.11(WR_N)
FT_XI: C130.1 IC8.21(XI) XT1.3(X)
FT_XO: C131.1 IC8.22(XO) XT1.1(X)
USB_D_N: ESD3.2(I/O_2) IC8.25(DM) J6.2(D-)
USB_D_P: ESD3.1(I/O_1) IC8.23(DP) J6.3(D+)
USB_SSRX_N: ESD3.7(I/O_5) IC8.34(RIDN) J6.8(StdA_SSTX-)
USB_SSRX_P: ESD3.8(I/O_6) IC8.35(RIDP) J6.9(StdA_SSTX+)
USB_SSTX_N: C127.1 ESD3.4(I/O_3) J6.5(StdA_SSRX-)
USB_SSTX_P: C128.1 ESD3.5(I/O_4) J6.6(StdA_SSRX+)
USB_SSTXI_N: C127.2 IC8.31(TODN)
USB_SSTXI_P: C128.2 IC8.32(TODP)
NetC129_1: C129.1 FR35.2 J6.10(Shield)
NetIC8_27: IC8.27(RREF) R60.2
NetIC8_58: IC8.58(CLK) R59.2
NetJ6_7: J6.7(GND_DRAIN) R53.2

Not connected (* = marked no-connect by the designer): IC8 17(GPIO0)* 18(GPIO1)* 19(RESERVE)*; J6 11(Mechanical)*

### Layout directives
net class FT_FIFO: FT_BE0, FT_BE1, FT_BE2, FT_BE3, FT_CLK, FT_D0, FT_D1, FT_D2, FT_D3, FT_D4, FT_D5, FT_D6, FT_D7, FT_D8, FT_D9, FT_D10, FT_D11, FT_D12, FT_D13, FT_D14, FT_D15, FT_D16, FT_D17, FT_D18, FT_D19, FT_D20, FT_D21, FT_D22, FT_D23, FT_D24, FT_D25, FT_D26, FT_D27, FT_D28, FT_D29, FT_D30, FT_D31, FT_OEn, FT_RXFn, FT_TXEn
net class VCC5P0: VCC5P0
differential pair: USB_D_N, USB_D_P, USB_SSRX_N, USB_SSRX_P, USB_SSTX_N, USB_SSTX_P, USB_SSTXI_N, USB_SSTXI_P
net class FT_USB: FT_VBUS, USB_D_N, USB_D_P, USB_SSRX_N, USB_SSRX_P, USB_SSTX_N, USB_SSTX_P, USB_SSTXI_N, USB_SSTXI_P
net class VD10_FT: VD10_FT
net class AVDD_FT: AVDD_FT

### Notes on the sheet
- NF elements on sheet: -
- Number of NF elements on sheet: 0
- USB 3.0 to FIFO interface
- USB 3.0 type A plug and ESD
- FTDI digital interface
- PCB note: palce near IC (top)
- PCB note: FT_FIFO lenghts must match
- FTDI Power
- PCB note: place near VCCIO
- PCB note: 10uF and 1uF place near pin 39; other caps near VD10
- Schematic note: marked 10uF caps (C134, C143, C151) not crucial and can be removed to reduce BOM price
- Project name:
- Title:
- Size:
- Date:
- A3
- Revision:
- Time:
- Sheet
- of
- File:

### Library data of the parts
C127 C128 C136 C138 C140 C142 C145 C147 C149 = Cap_0402: Manufacturer: Murata; Manufacturer Part Number 1: GRT033C81A104KE01D; Part Description: 0.1 µF ±10% 10V Ceramic Capacitor X6S 0201 (0603 Metric); Capacitance: 0.1 uF; Dielectric: X6S; Brand: Murata Electronics; Type: Voltage and Temperature Derating Recommended Product; Voltage Rating DC: 10 VDC; Product Status: New Product; Tolerance: 10 %; Value: 100nF, 10V; Package / Case: 0201 (0603 metric); Width: 0.3 mm; Minimum Order Quantity: 1; Category: Multilayer Ceramic Capacitors MLCC - SMD/SMT; Termination Style: SMD/SMT; Case Code - mm: 0603; Maximum Operating Temperature: + 125 C; Length: 0.6 mm; Product: General Type MLCCs; Case Code - in: 0201; RoHS: RoHS Compliant; Minimum Operating Temperature: - 55 C; RoHS - Mouser: Y; Height: 0.3 mm; Packaging: Reel; Series: GRM; Reeling: True; Supplier 1: Digi-Key; Supplier Part Number 1: 490-12232-1-ND
C129 C132 C133 = Cap_0603: Manufacturer Part Number 1: GRM155R71C104KA88D; Part Description: 0.10µF ±10% 16V X7R Ceramic Capacitor -55°C ~ 125°C Surface Mount, MLCC 0402 (1005 Metric) 0.039" L x 0.020" W (1.00mm x 0.50mm); Brand: Murata Electronics; Tolerance: 10 %; Type: General Purpose MLCC; Capacitance: 0.1 uF; Temperature Coefficient / Code: +/- 15 %; Case Height: 0.5 mm; Case Length: 1 mm; Dielectric: X7R; Supplier 1: Mouser; Supplier Part Number 1: 81-GRM155R71C104KA88; Case Code - in: 0402; Manufacturer: Murata Electronics; Category: Multilayer Ceramic Capacitors MLCC - SMD/SMT; Voltage Rating DC: 16 V; Value: 100nF, 16V; Manufacturer Part Number: GRM155R71C104KA88D; Case Code - mm: 1005; Case Width: 0.5 mm; Maximum Operating Temperature: + 125 C; Minimum Operating Temperature: - 55 C; Minimum Order Quantity: 1; Operating Temperature Range: - 55 C to + 125 C; Package / Case: 0402 (1005 metric); Packaging: Reel; Product: General Type MLCCs; Product Category: Low & Medium Capacitance SMD Ceramic Chip Capacitors; Reeling: True; RoHS - Mouser: Y; RoHS: RoHS Compliant; Series: GRM; Standard Pack Qty: 10000; Termination Style: SMD/SMT
C130 C131 = Cap_0402: Manufacturer: AVX; Manufacturer Part Number 1: 04023A100JAT2A; Part Description: 10pF ±5% 25V C0G, NP0 Ceramic Capacitor -55°C ~ 125°C Surface Mount, MLCC 0402 (1005 Metric) 0.039" L x 0.020" W (1.00mm x 0.50mm); Capacitance: 10; Ceramic Capacitor Case: 0402 [1005 Metric]; Capacitance Tolerance: ± 5%; Capacitor Case Style: 0402 [1005 Metric]<!--FANDB--><div class="features-and-benefits-container"></div>; Voltage Rating: 25; Supplier 1: Farnell; Supplier Part Number 1: 2332478RL; value: 10pF, 25V; Capacitance Tolerance ±: ± 5%; MSL: MSL 1 - Unlimited; Operating Temperature Max: 125; Operating Temperature Min: -55; Packaging: Cut Tape
C134 C143 C151 = Cap_0603: as C70 on sheet 07_LMS7002M_Power; Supplier 1: Digi-Key; Supplier Part Number 1: 311-1448-2-ND; Package / Case: 0603 (1608 Metric); Category: Capacitors; Voltage - Rated: 6.3V; Value: 10uF, 6.3V
C135 C137 C139 C141 C144 C152 = Cap_0402: Manufacturer: TDK Corporation; Manufacturer Part Number 1: JMK063ABJ105MP-F; Part Description: 1µF ±20% 6.3V X5R Ceramic Capacitor -55°C ~ 85°C Surface Mount, MLCC 0201 (0603 Metric) 0.024" L x 0.012" W (0.60mm x 0.30mm); Tolerance: ±20%; Capacitance: 1.0µF; Temperature Coefficient: X5R; Value: 1uF, 6.3V; Supplier 1: Digi-Key; Supplier Part Number 1: 587-5864-2-ND; Applications: General Purpose; Features: -; Lead Style: -; Ratings: -; Thickness (Max): -; Lead Spacing: -; Height - Seated (Max): -; Size / Dimension: 0.024" L x 0.012" W (0.60mm x 0.30mm); Mounting Type: Surface Mount, MLCC; Operating Temperature: -55°C ~ 85°C; Package / Case: 0201 (0603 Metric); Packaging: Cut Tape (CT); Voltage - Rated: 6.3V; Category: Capacitors; RoHS: RoHS Compliant
C146 C148 C150 = Cap_0402: Part Description: 10000pF ±10% 50V Ceramic Capacitor X7R 0402 (1005 Metric); Manufacturer: Murata; Manufacturer Part Number 1: GRM155R71H103KA88D; Tolerance: 10%; Dielectric: X7R; Material: Ceramic; Voltage: 25V; Value: 10nF, 50V; Supplier 1: Digi-Key; Supplier Part Number 1: 490-4516-1-ND; RoHS: Yes; Stock 1: 8941817; Pricing 1: 1=0,10000, 10=0,03800, 100=0,01690, 500=0,01208, 1000=0,00949, 2500=0,00862, 5000=0,00794 (USD); Packaging: Tape and Reel; Capacitance: 10nF; Case/Package: 0402; Case Code (Imperial): 0402; Case Code (Metric): 1005; Depth: 0.5mm; Height: 0.5mm; Lead Free: Lead Free; Length: 1mm; Max Operating Temperature: 125°C; Min Operating Temperature: -55°C; Mount: Surface Mount; Number of Pins: 2; Package Quantity: 1; Radiation Hardening: No; REACH SVHC: No SVHC; Termination: SMD/SMT; Thickness: 0.022inch; Voltage Rating (DC): 50V; Voltage Rating: 50V; Width: 0.02inch
C153 = Cap_0402: Manufacturer: Murata Electronics; Manufacturer Part Number: GRM155R71C104KA88D; Part Description: 0.10µF ±10% 16V X7R Ceramic Capacitor -55°C ~ 125°C Surface Mount, MLCC 0402 (1005 Metric) 0.039" L x 0.020" W (1.00mm x 0.50mm); Tolerance: 10 %; Type: General Purpose MLCC; Capacitance: 0.1 uF; Case Length: 1 mm; Dielectric: X7R; Case Height: 0.5 mm; Temperature Coefficient / Code: +/- 15 %; Value: 100nF, 16V; Supplier 1: Mouser; Supplier Part Number 1: 81-GRM155R71C104KA88; Case Code - in: 0402; RoHS: RoHS Compliant; Operating Temperature Range: - 55 C to + 125 C; Series: GRM; Termination Style: SMD/SMT; Package / Case: 0402 (1005 metric); Voltage Rating DC: 16 V; Maximum Operating Temperature: + 125 C; Case Code - mm: 1005; Minimum Operating Temperature: - 55 C; Product Category: Low & Medium Capacitance SMD Ceramic Chip Capacitors; Packaging: Reel; Product: General Type MLCCs; Category: Multilayer Ceramic Capacitors MLCC - SMD/SMT; Brand: Murata Electronics; Case Width: 0.5 mm; RoHS - Mouser: Y; Standard Pack Qty: 10000; Minimum Order Quantity: 1; Reeling: True; Manufacturer Part Number 1: GRM155R71C104KA88D
ESD3 = ESD7016: Manufacturer Part Number 1: ESD7016MUTAG; Manufacturer: ON Semiconductor; Part Description: TVS DIODE 5VWM 10VC 8UDFN; Unidirectional Channels: 8; Capacitance @ Frequency: 0.15pF @ 1MHz; Power Line Protection: No; Voltage - Reverse Standoff (Typ): 5V (Max); Voltage - Breakdown (Min): 5.5V; Current - Peak Pulse (10/1000µs): 1A (8/20µs); Voltage - Clamping (Max) @ Ipp: 10V; Supplier 1: Digi-Key; Category: Circuit Protection; RoHS: RoHS Compliant; Bidirectional Channels: -; Packaging: Digi-Reel®; Type: Zener; Operating Temperature: -55°C ~ 125°C (TJ); Mounting Type: Surface Mount; Power - Peak Pulse: -; Package / Case: 8-UFSFN; Supplier Device Package: 8-UDFN (3.3x1.0); Applications: General Purpose; Supplier Part Number 1: ESD7016MUTAGOSDKR-ND
FR35 FR37 = Ferrite: as FR22 on sheet 07_LMS7002M_Power; Supplier 1: Digi-Key; Package / Case: 0402 (1005 Metric); Category: Filters; Supplier Part Number 1: 445-9329-2-ND; Value: 220R, 0.9A
FR36 = Ferrite: as FR23 on sheet 07_LMS7002M_Power; Supplier 1: Digi-Key; Supplier Part Number 1: 445-2206-2-ND; Mounting Type: Surface Mount; RoHS: RoHS Compliant; Height (Max): 0.041" (1.05mm); Packaging: Tape & Reel (TR); Category: Filters; Current Rating: 2A; Package / Case: 0805 (2012 Metric); Size / Dimension: 0.079" L x 0.049" W (2.00mm x 1.25mm)
IC8 = FT601Q: Manufacturer: FTDI, Future Technology Devices International Ltd; Manufacturer Part Number 1: FT601Q-B-T; Part Description: IC USB3-32BIT SYNC FIFO 76QFN; Function: Bridge, USB to FIFO; Standards: USB 3.0; Voltage - Supply: 1.65 V ~ 3.6 V; Protocol: USB; Interface: FIFO; Supplier 1: Digi-Key; Operating Temperature: -40°C ~ 85°C; Packaging: Tray; Category: Integrated Circuits (ICs); Package / Case: 76-VFQFN Exposed Pad; Supplier Device Package: 76-QFN (9x9); Current - Supply: -; RoHS: RoHS Compliant; Supplier Part Number 1: 768-1311-ND
J6 = USB3.0_MALE: Manufacturer: Wurth Electronics Inc.; Manufacturer Part Number 1: 692112030100; Part Description: USB - A USB 3.0 (USB 3.1 Gen 1, Superspeed) Plug Connector 9 Position Surface Mount, Right Angle; Connector Type: USB - A; Number of Contacts: 9; Gender: Plug; Specifications: USB 3.0 (USB 3.1 Gen 1, Superspeed); Number of Ports: 1; Current Rating: 0.25A, 1.8A; Voltage - Rated: 30VAC; Mating Cycles: 5000; Shielding: Shielded; Material Flammability Rating: UL94 V-0; Supplier 1: Digi-Key; Supplier Part Number 1: 732-3157-ND; RoHS: RoHS Compliant; Category: Connectors, Interconnects; Stock 1: 2119; Pricing 1: 1=3, 10=2.65, 50=2.497, 100=2.242, 500=2.03802 (USD); Packaging: Tray; Part Status: Active; Mounting Type: Surface Mount, Right Angle; Mounting Feature: Horizontal; Termination: Solder; Features: Board Guide, Board Lock; Ingress Protection: -; Operating Temperature: -20°C ~ 85°C; Contact Finish: Gold; Shell/Shielding Material: Steel; Insulation Color: Blue; ComponentLink1URL: http://katalog.we-online.de/em/datasheet/692112030100.pdf; ComponentLink1Description: http://katalog.we-online.de/em/datasheet/692112030100.pdf
R53 = Res_0402: as R26 on sheet 07_LMS7002M_Power; Value: 0R; Supplier 1: Digi-Key; Supplier Part Number 1: 311-0.0JRTR-ND; Category: Resistors; Temperature Coefficient: -; Features: Moisture Resistant; Supplier Device Package: 0402; Height: 0.016" (0.40mm); Package / Case: 0402 (1005 Metric); Operating Temperature: -55°C ~ 155°C; Size / Dimension: 0.039" L x 0.020" W (1.00mm x 0.50mm); Composition: Thick Film; Packaging: Tape & Reel (TR); Number of Terminations: 2; RoHS: RoHS Compliant
R54-R56 R58 = Res_0402: as R39 on sheet 07_LMS7002M_Power; Value: 10k, 1%; Supplier 1: Digi-Key; Supplier Part Number 1: 311-10.0KLRTR-ND; Resistance (Ohms): 10k; Packaging: Tape & Reel (TR); RoHS: RoHS Compliant; Package / Case: 0402 (1005 Metric); Tolerance: ±1%; Operating Temperature: -55°C ~ 155°C; Size / Dimension: 0.039" L x 0.020" W (1.00mm x 0.50mm); Number of Terminations: 2; Category: Resistors; Height: 0.016" (0.40mm); Supplier Device Package: 0402; Features: Moisture Resistant; Composition: Thick Film
R57 = Res_0402: Manufacturer: Yageo; Manufacturer Part Number 1: RC0402FR-074K7L; Part Description: ±1% 0.063W, 1/16W Chip Resistor 0402 (1005 Metric) Moisture Resistant Thick Film; Power (Watts): 0.063W, 1/16W; Temperature Coefficient: ±100ppm/°C; Supplier 1: Digi-Key; Supplier Part Number 1: 311-4.7KLRCT-ND; RoHS: RoHS Compliant; Category: Resistors; Stock 1: 4788231; Pricing 1: 1=0.1, 10=0.014, 100=0.0056, 1000=0.00253, 2500=0.0022, 5000=0.00181 (USD); Packaging: Cut Tape (CT); Part Status: Active; Tolerance: ±1%; Composition: Thick Film; Features: Moisture Resistant; Operating Temperature: -55°C ~ 155°C; Package / Case: 0402 (1005 Metric); Supplier Device Package: 0402; Size / Dimension: 0.039" L x 0.020" W (1.00mm x 0.50mm); Height - Seated (Max): 0.016" (0.40mm); Failure Rate: -; ComponentLink1URL: http://www.yageo.com/documents/recent/PYu-RC_Group_51_RoHS_L_7.pdf; ComponentLink1Description: http://www.yageo.com/documents/recent/PYu-RC_Group_51_RoHS_L_7.pdf; Value: 4K7, 1%
R59 = Res_0402: Part Description: RES SMD 22 OHM 1% 1/16W 0402; Manufacturer Part Number 1: RC0402FR-0722RL; Manufacturer: Yageo; Tolerance: ±1%; Temperature Coefficient: ±100ppm/°C; Resistance (Ohms): 22; Supplier 1: Digi-Key; Supplier Part Number 1: 311-22.0LRTR-ND; Supplier Device Package: 0402; Composition: Thick Film; Category: Resistors; Value: 22R
R60 = Res_0402: Manufacturer Part Number 1: RC0402FR-071K6L; Manufacturer: Yageo; Part Description: RES SMD 1.6K OHM 1% 1/16W 0402; Resistance (Ohms): 1.6k; Temperature Coefficient: ±100ppm/°C; Power (Watts): 0.063W, 1/16W; Value: 1k6, 1%; Number of Terminations: 2; Height: 0.016" (0.40mm); Supplier Device Package: 0402; Size / Dimension: 0.039" L x 0.020" W (1.00mm x 0.50mm); Supplier Part Number 1: YAG3045CT-ND; Features: Moisture Resistant; Operating Temperature: -55°C ~ 155°C; Supplier 1: Digi-Key; Category: Resistors; RoHS: RoHS Compliant; Packaging: Cut Tape (CT); Composition: Thick Film; Tolerance: ±1%; Package / Case: 0402 (1005 Metric)
XT1 = CRYSTAL_19M2: Oscillator Crystal 25 MHz; Manufacturer: AVX Corp/Kyocera Corp; Manufacturer Part Number 1: CX3225SB30000D0FPLCC; Part Description: 30MHz ±10ppm Crystal 8pF 50 Ohm -40°C ~ 85°C Surface Mount 4-SMD, No Lead (DFN, LCC); Operating Mode: Fundamental; Frequency Tolerance: ±10ppm; Frequency Stability: ±20ppm; Load Capacitance: 8pF; ESR (Equivalent Series Resistance): 50 Ohm; Height: 0.024" (0.60mm); Size / Dimension: 0.126" L x 0.098" W (3.20mm x 2.50mm); Mounting Type: Surface Mount; Package / Case: 4-SMD, No Lead (DFN, LCC); Category: Crystals and Oscillators; Ratings: -; Supplier 1: Digi-Key; Operating Temperature: -40°C ~ 85°C; Packaging: Cut Tape (CT); RoHS: RoHS Compliant; Type: MHz Crystal; Supplier Part Number 1: 1253-1368-1-ND; Frequency: 30MHz; Value: 30MHz

## Sheet 10_Misc.SchDoc: Misc
size A3; Organization: Lime Microsystems; Address1: Surrey Tech Centre; Address2: Guildford GU2 7YG; Address3: Surrey; Address4: United Kingdom; Revision: v2.4; SheetNumber: 10; SheetTotal: 10
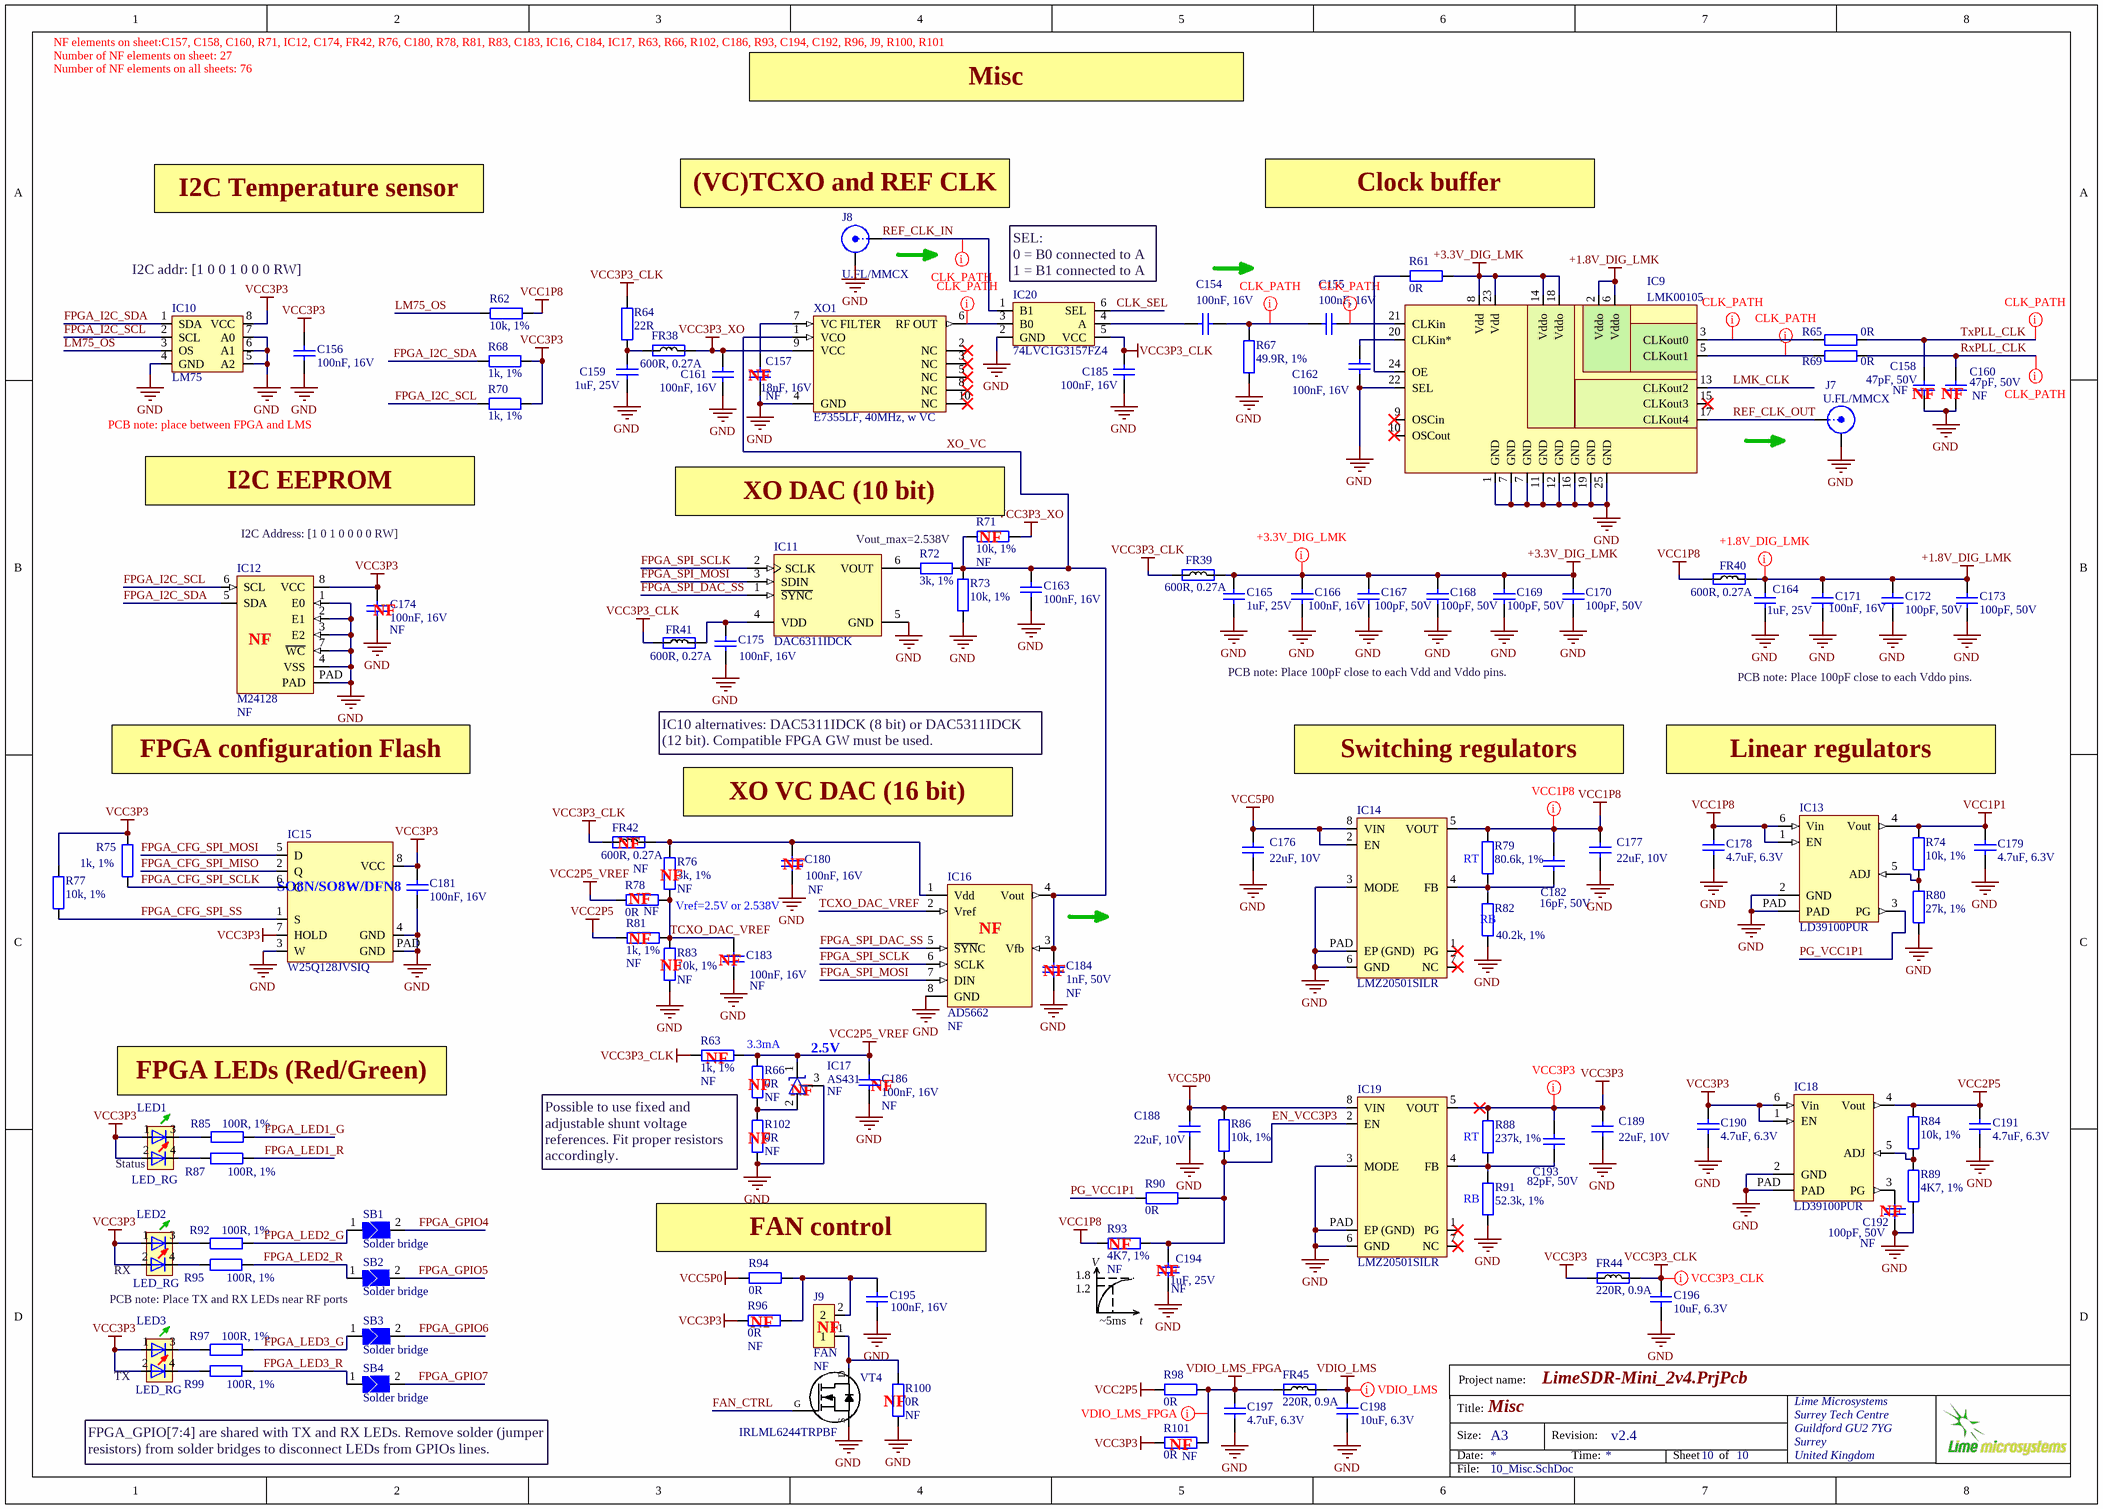
[diagram p4: 10_Misc.SchDoc]

### Parts
C154  100nF, 16V  [CAP0402]
C155  100nF, 16V  [CAP0402]
C156  100nF, 16V  [CAP0402]
C157  18nF, 16V  Assembly Info: NF  [CAP0402]
C158  47pF, 50V  Assembly Info: NF  [CAP0402]
C159  1uF, 25V  [CAP0402]
C160  47pF, 50V  Assembly Info: NF  [CAP0402]
C161  100nF, 16V  [CAP0402]
C162  100nF, 16V  [CAP0402]
C163  100nF, 16V  [CAP0402]
C164  1uF, 25V  [CAP0402]
C165  1uF, 25V  [CAP0402]
C166  100nF, 16V  [CAP0402]
C167  100pF, 50V  [CAP0402]
C168  100pF, 50V  [CAP0402]
C169  100pF, 50V  [CAP0402]
C170  100pF, 50V  [CAP0402]
C171  100nF, 16V  [CAP0402]
C172  100pF, 50V  [CAP0402]
C173  100pF, 50V  [CAP0402]
C174  100nF, 16V  Assembly Info: NF  [CAP0402]
C175  100nF, 16V  [CAP0402]
C176  22uF, 10V  [CAP0603]
C177  22uF, 10V  [CAP0603]
C178  4.7uF, 6.3V  [CAP0402]
C179  4.7uF, 6.3V  [CAP0402]
C180  100nF, 16V  Assembly Info: NF  [CAP0402]
C181  100nF, 16V  [CAP0402]
C182  16pF, 50V  [CAP0402]
C183  100nF, 16V  Assembly Info: NF  [CAP0402]
C184  1nF, 50V  Assembly Info: NF  [CAP0402]
C185  100nF, 16V  [CAP0402]
C186  100nF, 16V  Assembly Info: NF  [CAP0402]
C188  22uF, 10V  [CAP0603]
C189  22uF, 10V  [CAP0603]
C190  4.7uF, 6.3V  [CAP0402]
C191  4.7uF, 6.3V  [CAP0402]
C192  100pF, 50V  Assembly Info: NF  [CAP0402]
C193  82pF, 50V  [CAP0402]
C194  1uF, 25V  Assembly Info: NF  [CAP0402]
C195  100nF, 16V  [CAP0402]
C196  10uF, 6.3V  [CAP0603]
C197  4.7uF, 6.3V  [CAP0402]
C198  10uF, 6.3V  [CAP0603]
FR38  600R, 0.27A  [RES0201]
FR39  600R, 0.27A  [RES0201]
FR40  600R, 0.27A  [RES0201]
FR41  600R, 0.27A  [RES0201]
FR42  600R, 0.27A  Assembly Info: NF  [RES0201]
FR44  220R, 0.9A  [RES0402]
FR45  220R, 0.9A  [RES0402]
IC9  LMK00105  [LMK00105SQ]
IC10  LM75  [HWSON8_LM75]
IC11  DAC6311IDCK  [AD5601_SOT23-6]
IC12  M24128  Assembly Info: NF  [M24128-DFMC6TG]
IC13  LD39100PUR  [LD39100PUR]
IC14  LMZ20501SILR  [LMZ20501SILR_DC-DC_8-SMD]
IC15  W25Q128JVSIQ  [S25FL164K_WSON8_DFN6]
IC16  AD5662  Assembly Info: NF  [AD5662_SOT23-8]
IC17  AS431  Assembly Info: NF  [SOT23-3_V3]
IC18  LD39100PUR  [LD39100PUR]
IC19  LMZ20501SILR  [LMZ20501SILR_DC-DC_8-SMD]
IC20  74LVC1G3157FZ4  [74LVC1G3157FZ4_SPDT_SW_DFN1410-6]
J7  U.FL/MMCX  [MMCX_UFL_conn_u]
J8  U.FL/MMCX  [MMCX_UFL_conn_u]
J9  FAN  Assembly Info: NF  [Header2x1_TH_v2]
LED1  LED_RG  [LED-2x0603]
LED2  LED_RG  [LED-2x0603]
LED3  LED_RG  [LED-2x0603]
R61  0R  [RES0402]
R62  10k, 1%  [RES0402]
R63  1k, 1%  Assembly Info: NF  [RES0402]
R64  22R  [RES0402]
R65  0R  [RES0402]
R66  0R  Assembly Info: NF  [RES0402]
R67  49.9R, 1%  [RES0402]
R68  1k, 1%  [RES0402]
R69  0R  [RES0402]
R70  1k, 1%  [RES0402]
R71  10k, 1%  Assembly Info: NF  [RES0402]
R72  3k, 1%  [RES0402]
R73  10k, 1%  [RES0402]
R74  10k, 1%  [RES0402]
R75  1k, 1%  [RES0402]
R76  3k, 1%  Assembly Info: NF  [RES0402]
R77  10k, 1%  [RES0402]
R78  0R  Assembly Info: NF  [RES0402]
R79  80.6k, 1%  [RES0402]
R80  27k, 1%  [RES0402]
R81  1k, 1%  Assembly Info: NF  [RES0402]
R82  40.2k, 1%  [RES0402]
R83  10k, 1%  Assembly Info: NF  [RES0402]
R84  10k, 1%  [RES0402]
R85  100R, 1%  [RES0402]
R86  10k, 1%  [RES0402]
R87  100R, 1%  [RES0402]
R88  237k, 1%  [RES0402]
R89  4K7, 1%  [RES0402]
R90  0R  [RES0402]
R91  52.3k, 1%  [RES0402]
R92  100R, 1%  [RES0402]
R93  4K7, 1%  Assembly Info: NF  [RES0402]
R94  0R  [RES0402]
R95  100R, 1%  [RES0402]
R96  0R  Assembly Info: NF  [RES0402]
R97  100R, 1%  [RES0402]
R98  0R  [RES0402]
R99  100R, 1%  [RES0402]
R100  0R  Assembly Info: NF  [RES0402]
R101  0R  Assembly Info: NF  [RES0402]
R102  0R  Assembly Info: NF  [RES0402]
SB1  Solder bridge  [SOLDER_BRIDGE_TRIANGULAR_v2]
SB2  Solder bridge  [SOLDER_BRIDGE_TRIANGULAR_v2]
SB3  Solder bridge  [SOLDER_BRIDGE_TRIANGULAR_v2]
SB4  Solder bridge  [SOLDER_BRIDGE_TRIANGULAR_v2]
VT4  IRLML6244TRPBF  [SOT23-3]
XO1  E7355LF, 40MHz, w VC  [RAKON_RTX5032A]

### Nets
+1.8V_DIG_LMK: C164.2 C171.2 C172.2 C173.2 FR40.2 IC9.2(Vddo) IC9.6(Vddo)
+3.3V_DIG_LMK: C165.2 C166.2 C167.2 C168.2 C169.2 C170.2 FR39.2 IC9.8(Vdd) IC9.14(Vddo) IC9.18(Vddo) IC9.23(Vdd) R61.2
GND: C156.2 C157.1 C158.1 C159.1 C160.1 C161.1 C162.1 C163.1 C164.1 C165.1 C166.1 C167.1 C168.1 C169.1 C170.1 C171.1 C172.1 C173.1 C174.2 C175.2 C176.1 C177.1 C178.1 C179.1 C180.2 C181.2 C183.2 C184.2 C185.1 C186.1 C188.1 C189.1 C190.1 C191.1 C192.1 C194.1 C195.2 C196.1 C197.1 C198.1 IC9.1(GND) IC9.7(GND) IC9.11(GND) IC9.12(GND) IC9.16(GND) IC9.19(GND) IC9.22(SEL) IC9.25(GND) IC10.4(GND) IC10.5(A2) IC10.6(A1) IC10.7(A0) IC11.5(GND) IC12.1(E0) IC12.2(E1) IC12.3(E2) IC12.4(VSS) IC12.7(~{WC}) IC12.PAD IC13.2(GND) IC13.PAD IC14.3(MODE) IC14.6(GND) IC14.PAD(EP_(GND)) IC15.3(W) IC15.4(GND) IC15.PAD(GND) IC16.8(GND) IC17.3(NC/A) IC18.2(GND) IC18.PAD IC19.3(MODE) IC19.6(GND) IC19.PAD(EP_(GND)) IC20.2(GND) J7.2(Y) J8.2(Y) R67.1 R73.2 R80.2 R82.1 R83.2 R89.2 R91.1 R100.1 R102.2 VT4.S XO1.4(GND)
VCC1P1: C179.2 IC13.4(Vout) R74.2
VCC1P8: C177.2 C178.2 C182.1 FR40.1 IC13.1(EN) IC13.6(Vin) IC14.5(VOUT) R62.2 R79.2 R93.2
VCC2P5: C191.2 IC18.4(Vout) R81.2 R84.2 R98.1
VCC2P5_VREF: C186.2 IC17.1(K) R63.1 R66.1 R78.1
VCC3P3: C156.1 C174.1 C181.1 C189.2 C190.2 C193.1 FR44.1 IC10.8(VCC) IC12.8(VCC) IC15.7(HOLD) IC15.8(VCC) IC18.1(EN) IC18.6(Vin) IC19.5(VOUT) LED1.1 LED1.2 LED2.1 LED2.2 LED3.1 LED3.2 R68.1 R70.1 R75.2 R77.2 R88.2 R96.1 R101.1
VCC3P3_CLK: C185.2 C196.2 FR39.1 FR41.1 FR42.1 FR44.2 IC20.5(VCC) R63.2 R64.2
VCC3P3_XO: C161.2 FR38.2 R71.2 XO1.9(VCC)
VCC5P0: C176.2 C188.2 IC14.2(EN) IC14.8(VIN) IC19.8(VIN) R86.2 R94.1
VDIO_LMS: C198.2 FR45.2
VDIO_LMS_FPGA: C197.2 FR45.1 R98.2 R101.2
CLK_SEL: IC20.6(SEL)
EN_VCC3P3: C194.2 IC19.2(EN) R86.1 R90.2 R93.1
FAN_CTRL: VT4.G
FPGA_CFG_SPI_MISO: IC15.2(Q)
FPGA_CFG_SPI_MOSI: IC15.5(D)
FPGA_CFG_SPI_SCLK: IC15.6(C) R75.1
FPGA_CFG_SPI_SS: IC15.1(S) R77.1
FPGA_GPIO4: SB1.2
FPGA_GPIO5: SB2.2
FPGA_GPIO6: SB3.2
FPGA_GPIO7: SB4.2
FPGA_I2C_SCL: IC10.2(SCL) IC12.6(SCL) R70.2
FPGA_I2C_SDA: IC10.1(SDA) IC12.5(SDA) R68.2
FPGA_LED1_G: R85.2
FPGA_LED1_R: R87.2
FPGA_LED2_G: R92.2 SB1.1
FPGA_LED2_R: R95.2 SB2.1
FPGA_LED3_G: R97.2 SB3.1
FPGA_LED3_R: R99.2 SB4.1
FPGA_SPI_DAC_SS: IC11.1(~{SYNC}) IC16.5(~{SYN}C)
FPGA_SPI_MOSI: IC11.3(SDIN) IC16.7(DIN)
FPGA_SPI_SCLK: IC11.2(SCLK) IC16.6(SCLK)
LM75_OS: IC10.3(OS) R62.1
LMK_CLK: IC9.13(CLKout2)
PG_VCC1P1: IC13.3(PG) R90.1
REF_CLK_IN: IC20.1(B1) J8.1(X)
REF_CLK_OUT: IC9.17(CLKout4) J7.1(X)
RxPLL_CLK: C160.2 R69.1
TCXO_DAC_VREF: C183.1 IC16.2(Vref) R76.1 R78.2 R81.1 R83.1
TxPLL_CLK: C158.2 R65.1
XO_VC: C163.2 C184.1 IC16.3(Vfb) IC16.4(Vout) R71.1 R72.1 R73.1 XO1.1(VCO)
NetC154_1: C154.1 C155.2 R67.2
NetC154_2: C154.2 IC20.4(A)
NetC155_1: C155.1 IC9.21(CLKin)
NetC157_2: C157.2 XO1.7(VC_FILTER)
NetC159_2: C159.2 FR38.1 R64.1
NetC162_2: C162.2 IC9.20(CLKin*)
NetC175_1: C175.1 FR41.2 IC11.4(VDD)
NetC180_1: C180.1 FR42.2 IC16.1(Vdd) R76.2
NetC182_2: C182.2 IC14.4(FB) R79.1 R82.2
NetC192_2: C192.2 IC18.3(PG)
NetC193_2: C193.2 IC19.4(FB) R88.1 R91.2
NetC195_1: C195.1 J9.2 R94.2 R96.2
NetIC9_3: IC9.3(CLKout0) R65.2
NetIC9_5: IC9.5(CLKout1) R69.2
NetIC9_24: IC9.24(OE) R61.1
NetIC11_6: IC11.6(VOUT) R72.2
NetIC13_5: IC13.5(ADJ) R74.1 R80.1
NetIC17_2: IC17.2(A) R66.2 R102.1
NetIC18_5: IC18.5(ADJ) R84.1 R89.1
NetIC20_3: IC20.3(B0) XO1.6(RF_OUT)
NetJ9_1: J9.1 R100.2 VT4.D
NetLED1_3: LED1.3 R85.1
NetLED1_4: LED1.4 R87.1
NetLED2_3: LED2.3 R92.1
NetLED2_4: LED2.4 R95.1
NetLED3_3: LED3.3 R97.1
NetLED3_4: LED3.4 R99.1

Not connected (* = marked no-connect by the designer): IC9 9(OSCin)* 10(OSCout)* 15(CLKout3)*; IC14 1(PG)* 7(NC)*; IC19 1(PG)* 7(NC)*; XO1 2(NC)* 3(NC)* 5(NC)* 8(NC)* 10(NC)*

### Layout directives
net class CLK_PATH: NetC154_1, NetC155_1, NetIC9_3, NetIC9_5, NetIC20_3, REF_CLK_IN, RxPLL_CLK, TxPLL_CLK
net class +3.3V_DIG_LMK: +3.3V_DIG_LMK
net class +1.8V_DIG_LMK: +1.8V_DIG_LMK
net class VCC3P3_CLK: VCC3P3_CLK
net class VCC1P8: VCC1P8
net class VDIO_LMS: VDIO_LMS
net class VDIO_LMS_FPGA: VDIO_LMS_FPGA
net class VCC3P3: VCC3P3

### Notes on the sheet
- NF elements on sheet:C157, C158, C160, R71, IC12, C174, FR42, R76, C180, R78, R81, R83, C183, IC16, C184, IC17, R63, R66, R102, C186, R93, C194, C192, R96, J9, R100, R101
- Number of NF elements on sheet: 27
- Number of NF elements on all sheets: 76
- Misc
- I2C Temperature sensor
- (near J8) (VC)TCXO and REF CLK
- Clock buffer
- I2C addr: [1 0 0 1 0 0 0 RW]
- (near IC20) SEL:
  0 = B0 connected to A
  1 = B1 connected to A
- (near C157) NF
- PCB note: place between FPGA and LMS
- (near C158) NF
- (near C160) NF
- I2C EEPROM
- (near R71) XO DAC (10 bit)
- I2C Address: [1 0 1 0 0 0 0 RW]
- Vout_max=2.538V
- (near R71) NF
- (near IC12) NF
- (near C174) NF
- PCB note: Place 100pF close to each Vdd and Vddo pins.
- PCB note: Place 100pF close to each Vddo pins.
- (near IC12) FPGA configuration Flash
- IC10 alternatives: DAC5311IDCK (8 bit) or DAC5311IDCK (12 bit). Compatible FPGA GW must be used.
- Switching regulators
- Linear regulators
- (near FR42) NF
- XO VC DAC (16 bit)
- (near R78) NF
- (near R76) NF
- Vref=2.5V or 2.538V
- (near C180) NF
- RT
- (near R82) RB
- (near R81) NF
- (near R83) NF
- (near C183) NF
- (near IC16) NF
- NF
- 3.3mA
- 2.5V
- FPGA LEDs (Red/Green)
- (near R63) NF
- (near R66) NF
- (near IC17) NF
- (near C186) NF
- (near LED1) Status
- Possible to use fixed and adjustable shunt voltage references. Fit proper resistors accordingly.
- (near R102) NF
- FAN control
- (near R93) NF
- RB
- (near SB2) PCB note: Place TX and RX LEDs near RF ports
- (near LED2) RX
- (near R96) NF
- (near R93) 1.8
- (near R93) 1.2
- (near R93) V
- ~5ms
- t
- (near C194) NF
- (near LED3) TX
- (near J9) NF
- FPGA_GPIO[7:4] are shared with TX and RX LEDs. Remove solder (jumper resistors) from solder bridges to disconnect LEDs from GPIOs lines.
- (near R100) NF
- (near R101) NF
- Project name:
- Title:
- Size:
- Date:
- A3
- Revision:
- Time:
- Sheet
- of
- File:
- (in symbol M25P40_with_pad) SO8N/SO8W/DFN8